# EAGLE design quadcopter (EAGLE 9.3.0)
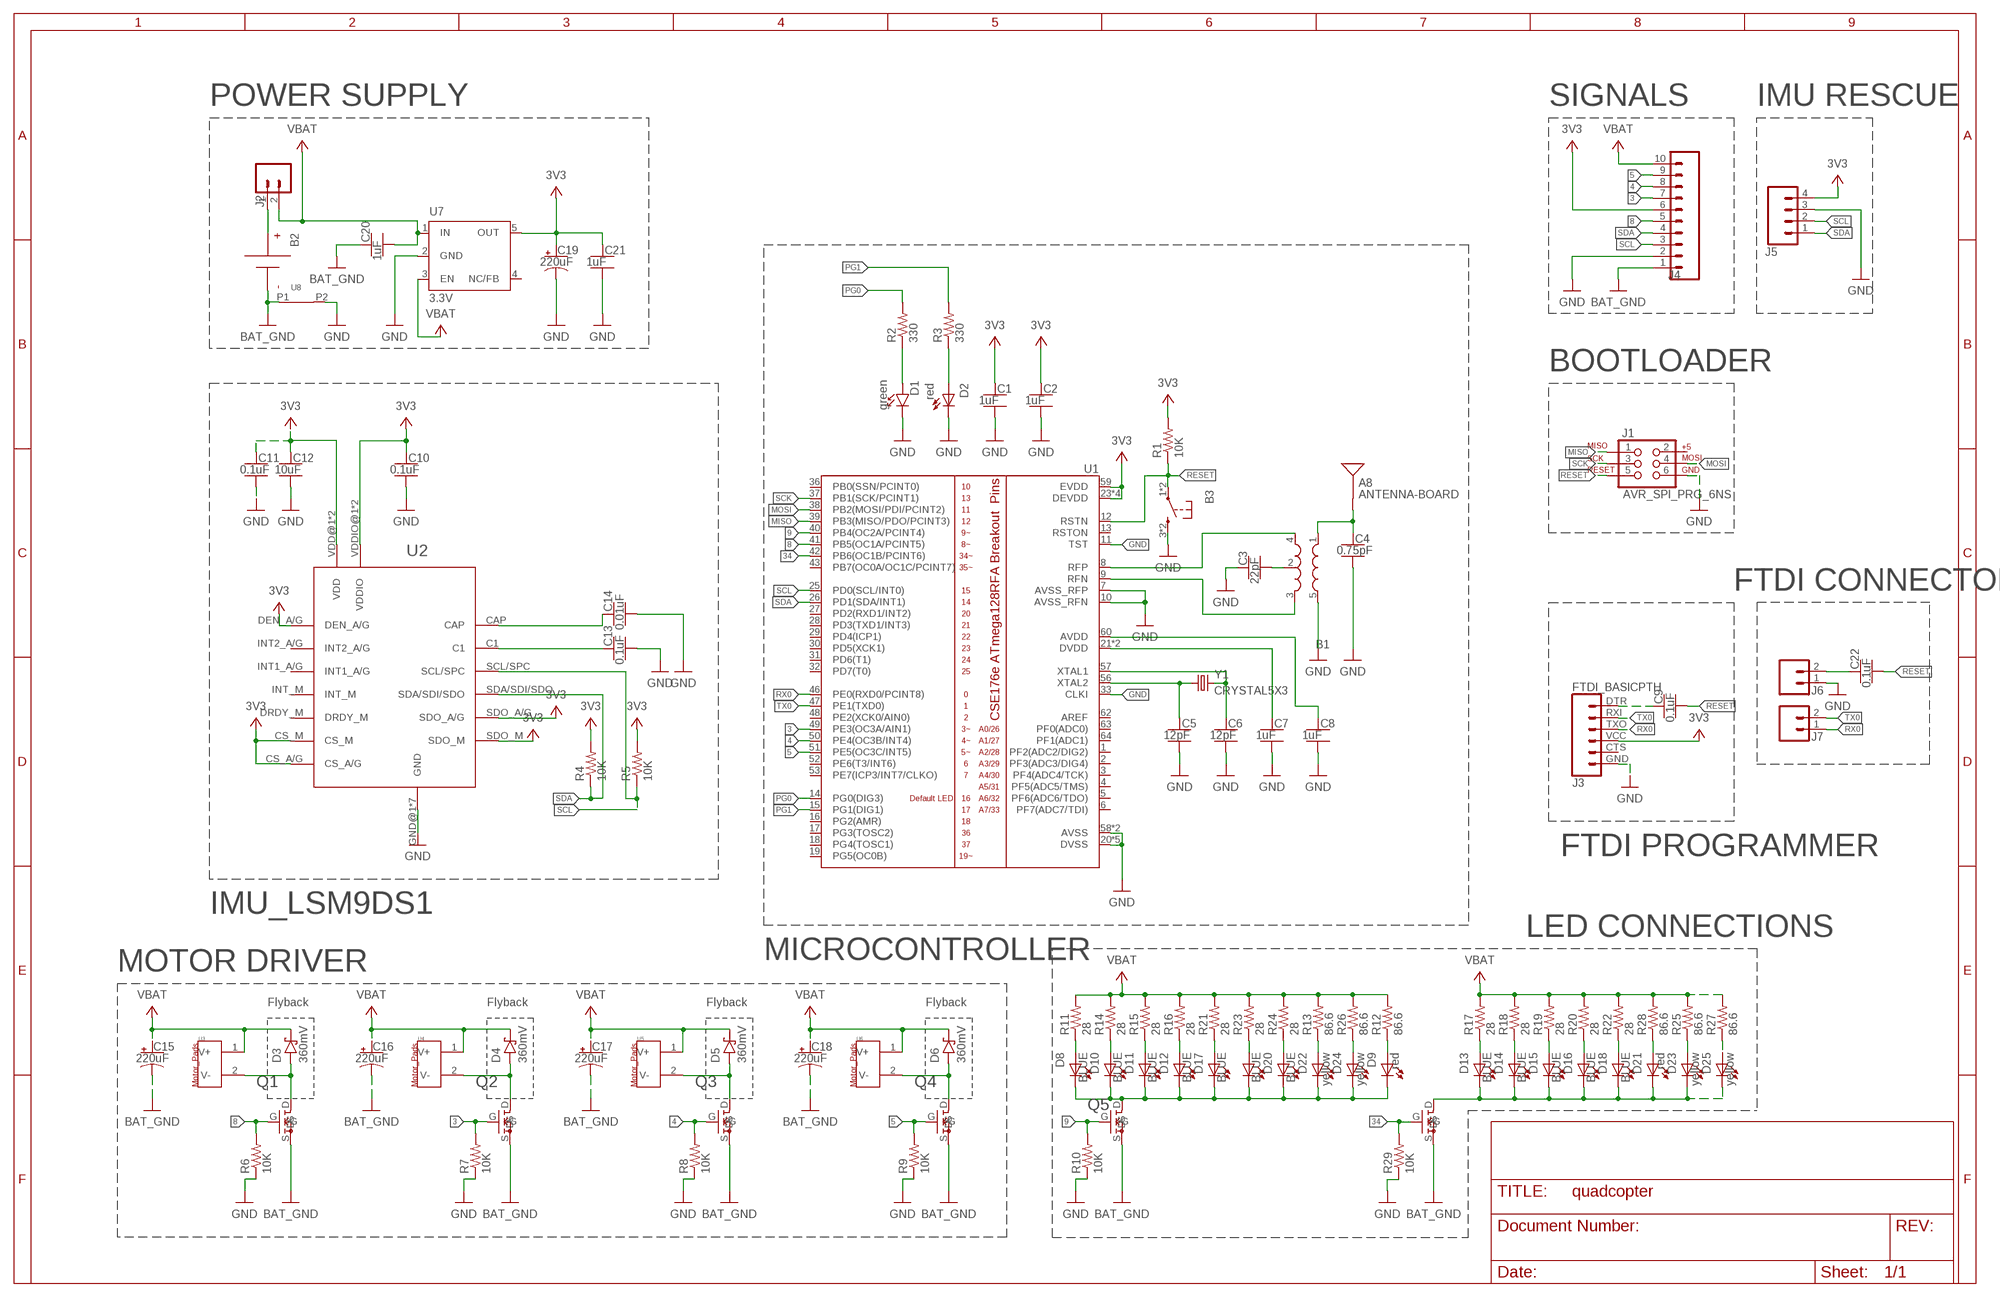
[diagram p0: schematic, sheet 1]
FRAME1 (FRAME_B_L): CREATOR: Unknown; DIST: Unknown; DISTPN: Unknown

## Parts
A8  ANTENNA-BOARD  [ANT_PCB_2.4GHZ_NRF8001_1.6MM_1OZ]
B1  BALUN0805  [BALUN]
B2  BATTERY-SCREW-TERMINAL  [SCREW-TERMINAL-1X2-2.54MM]
B3  PUSHBUTTON_-4.5X4.5  [4.5MM_TACTILE_SWITCH_TL3305AF160QG]
C1  1uF  CAPACITOR-NP_SMD-2012-0805_CERAMIC-1UF  [CAPC2012X140_HS]
C2  1uF  CAPACITOR-NP_SMD-2012-0805_CERAMIC-1UF  [CAPC2012X140_HS]
C3  22pF  CAPACITOR-NP_SMD-2012-0805_CERAMIC-22PF  [CAPC2012X140_HS]
C4  0.75pF  CAPACITOR-NP_SMD-2012-0805_CERAMIC-0.75PF  [CAPC2012X140_HS]
C5  12pF  CAPACITOR-NP_SMD-2012-0805_CERAMIC-12PF  [CAPC2012X140_HS]
C6  12pF  CAPACITOR-NP_SMD-2012-0805_CERAMIC-12PF  [CAPC2012X140_HS]
C7  1uF  CAPACITOR-NP_SMD-2012-0805_CERAMIC-1UF  [CAPC2012X140_HS]
C8  1uF  CAPACITOR-NP_SMD-2012-0805_CERAMIC-1UF  [CAPC2012X140_HS]
C9  0.1uF  CAPACITOR-NP_SMD-2012-0805_CERAMIC-0.1UF  [CAPC2012X140_HS]
C10  0.1uF  CAPACITOR-NP_SMD-2012-0805_CERAMIC-0.1UF  [CAPC2012X140_HS]
C11  0.1uF  CAPACITOR-NP_SMD-2012-0805_CERAMIC-0.1UF  [CAPC2012X140_HS]
C12  10uF  CAPACITOR-NP_SMD-2012-0805_CERAMIC-10UF  [CAPC2012X140_HS]
C13  0.1uF  CAPACITOR-NP_SMD-2012-0805_CERAMIC-0.1UF  [CAPC2012X140_HS]
C14  0.01uF  CAPACITOR-NP_SMD-2012-0805_CERAMIC-0.01UF  [CAPC2012X140_HS]
C15  220uF  CAPACITOR-POL_SMD-7043-D_TANTALUM-220UF  [CAPMP7343X310_HS]
C16  220uF  CAPACITOR-POL_SMD-7043-D_TANTALUM-220UF  [CAPMP7343X310_HS]
C17  220uF  CAPACITOR-POL_SMD-7043-D_TANTALUM-220UF  [CAPMP7343X310_HS]
C18  220uF  CAPACITOR-POL_SMD-7043-D_TANTALUM-220UF  [CAPMP7343X310_HS]
C19  220uF  CAPACITOR-POL_SMD-7043-D_TANTALUM-220UF  [CAPMP7343X310_HS]
C20  1uF  CAPACITOR-NP_SMD-2012-0805_CERAMIC-1UF  [CAPC2012X140_HS]
C21  1uF  CAPACITOR-NP_SMD-2012-0805_CERAMIC-1UF  [CAPC2012X140_HS]
C22  0.1uF  CAPACITOR-NP_SMD-2012-0805_CERAMIC-0.1UF  [CAPC2012X140_HS]
D1  green  DIODE-LED_SMD-2012-0805-GREEN  [LEDSC125X200X120-2_HS]
D2  red  DIODE-LED-LITEON-C170EKT-RED-LITEON-C170EKT-RED-LED  [LED]
D3  360mV  DIODE-SCHOTTKY_SMD-SOD123-360MV  [SOD3716X135_HS]
D4  360mV  DIODE-SCHOTTKY_SMD-SOD123-360MV  [SOD3716X135_HS]
D5  360mV  DIODE-SCHOTTKY_SMD-SOD123-360MV  [SOD3716X135_HS]
D6  360mV  DIODE-SCHOTTKY_SMD-SOD123-360MV  [SOD3716X135_HS]
D8  BLUE  DIODE-LED-SMD-2012-0805-BLUE-BLUE  [DIODE-LED-LTST-C170]
D9  red  DIODE-LED-SMD-2012-0805-RED-RED  [DIODE-LED-LTST-C170]
D10  BLUE  DIODE-LED-SMD-2012-0805-BLUE-BLUE  [DIODE-LED-LTST-C170]
D11  BLUE  DIODE-LED-SMD-2012-0805-BLUE-BLUE  [DIODE-LED-LTST-C170]
D12  BLUE  DIODE-LED-SMD-2012-0805-BLUE-BLUE  [DIODE-LED-LTST-C170]
D13  BLUE  DIODE-LED-SMD-2012-0805-BLUE-BLUE  [DIODE-LED-LTST-C170]
D14  BLUE  DIODE-LED-SMD-2012-0805-BLUE-BLUE  [DIODE-LED-LTST-C170]
D15  BLUE  DIODE-LED-SMD-2012-0805-BLUE-BLUE  [DIODE-LED-LTST-C170]
D16  BLUE  DIODE-LED-SMD-2012-0805-BLUE-BLUE  [DIODE-LED-LTST-C170]
D17  BLUE  DIODE-LED-SMD-2012-0805-BLUE-BLUE  [DIODE-LED-LTST-C170]
D18  BLUE  DIODE-LED-SMD-2012-0805-BLUE-BLUE  [DIODE-LED-LTST-C170]
D19  BLUE  DIODE-LED-SMD-2012-0805-BLUE-BLUE  [DIODE-LED-LTST-C170]
D20  BLUE  DIODE-LED-SMD-2012-0805-BLUE-BLUE  [DIODE-LED-LTST-C170]
D21  red  DIODE-LED-SMD-2012-0805-RED-RED  [DIODE-LED-LTST-C170]
D22  yellow  DIODE-LED-SMD-2012-0805-YELLOW-YELLOW  [DIODE-LED-LTST-C170]
D23  yellow  DIODE-LED-SMD-2012-0805-YELLOW-YELLOW  [DIODE-LED-LTST-C170]
D24  yellow  DIODE-LED-SMD-2012-0805-YELLOW-YELLOW  [DIODE-LED-LTST-C170]
D25  yellow  DIODE-LED-SMD-2012-0805-YELLOW-YELLOW  [DIODE-LED-LTST-C170]
J1  AVR_SPI_PRG_6NS  [2X3-NS]
J2  HEADER-0.1IN-2POS-MALE  [HDRV2W63P254_2X1_508X254H838_HS]
J3  FTDI_BASICPTH  [FTDI_BASIC]
J4  HEADER-10POSTH-254X10  [HDRV10W63P254_10X1_2540X254H838_HS]
J5  HEADER-4POS-0.1IN-FEMALE  [HDRVR4W80P254_1X4_1066X254X850B]
J6  HEADER-0.1IN-2POS-FEMALE  [HDRV2W63P254_2X1_508X254H838_HS]
J7  HEADER-0.1IN-2POS-FEMALE  [HDRV2W63P254_2X1_508X254H838_HS]
Q1  MOSFET-VISHAY-SOT23-N-MOSFET  [SOT-23_N_MOSFET]
Q2  MOSFET-VISHAY-SOT23-N-MOSFET  [SOT-23_N_MOSFET]
Q3  MOSFET-VISHAY-SOT23-N-MOSFET  [SOT-23_N_MOSFET]
Q4  MOSFET-VISHAY-SOT23-N-MOSFET  [SOT-23_N_MOSFET]
Q5  MOSFET-VISHAY-SOT23-N-MOSFET  [SOT-23_N_MOSFET]
Q6  MOSFET-VISHAY-SOT23-N-MOSFET  [SOT-23_N_MOSFET]
R1  10K  RESISTOR_SMD-2012-0805-10K  [RESC2012X60_HS]
R2  330  RESISTOR_SMD-2012-0805-330  [RESC2012X60_HS]
R3  330  RESISTOR_SMD-2012-0805-330  [RESC2012X60_HS]
R4  10K  RESISTOR_SMD-2012-0805-10K  [RESC2012X60_HS]
R5  10K  RESISTOR_SMD-2012-0805-10K  [RESC2012X60_HS]
R6  10K  RESISTOR_SMD-2012-0805-10K  [RESC2012X60_HS]
R7  10K  RESISTOR_SMD-2012-0805-10K  [RESC2012X60_HS]
R8  10K  RESISTOR_SMD-2012-0805-10K  [RESC2012X60_HS]
R9  10K  RESISTOR_SMD-2012-0805-10K  [RESC2012X60_HS]
R10  10K  RESISTOR_SMD-2012-0805-10K  [RESC2012X60_HS]
R11  28  RESISTOR_SMD-2012-0805-28  [RESC2012X60_HS]
R12  86.6  RESISTOR_SMD-2012-0805-88.6  [RESC2012X60_HS]
R13  86.6  RESISTOR_SMD-2012-0805-88.6  [RESC2012X60_HS]
R14  28  RESISTOR_SMD-2012-0805-28  [RESC2012X60_HS]
R15  28  RESISTOR_SMD-2012-0805-28  [RESC2012X60_HS]
R16  28  RESISTOR_SMD-2012-0805-28  [RESC2012X60_HS]
R17  28  RESISTOR_SMD-2012-0805-28  [RESC2012X60_HS]
R18  28  RESISTOR_SMD-2012-0805-28  [RESC2012X60_HS]
R19  28  RESISTOR_SMD-2012-0805-28  [RESC2012X60_HS]
R20  28  RESISTOR_SMD-2012-0805-28  [RESC2012X60_HS]
R21  28  RESISTOR_SMD-2012-0805-28  [RESC2012X60_HS]
R22  28  RESISTOR_SMD-2012-0805-28  [RESC2012X60_HS]
R23  28  RESISTOR_SMD-2012-0805-28  [RESC2012X60_HS]
R24  28  RESISTOR_SMD-2012-0805-28  [RESC2012X60_HS]
R25  86.6  RESISTOR_SMD-2012-0805-88.6  [RESC2012X60_HS]
R26  86.6  RESISTOR_SMD-2012-0805-88.6  [RESC2012X60_HS]
R27  86.6  RESISTOR_SMD-2012-0805-88.6  [RESC2012X60_HS]
R28  86.6  RESISTOR_SMD-2012-0805-88.6  [RESC2012X60_HS]
R29  10K  RESISTOR_SMD-2012-0805-10K  [RESC2012X60_HS]
U1  ATMEGA128RFA1  [QFN-64]
U2  IMU_LSM-ST-LSM9DS1-IMU-LGA  [LSM9DS1_IMU]
U3  MOTOR_PADS-MOLEX-0530470210  [MOLEX-0530470210]
U4  MOTOR_PADS-MOLEX-0530470210  [MOLEX-0530470210]
U5  MOTOR_PADS-MOLEX-0530470210  [MOLEX-0530470210]
U6  MOTOR_PADS-MOLEX-0530470210  [MOLEX-0530470210]
U7  3.3V  TPS73633-DBVT3V3  [SOT23-DBV]
U8  NET_BRIDGE-BRIDGE-SMD  [NET_BRIDGE]
Y1  CRYSTAL5X3  [CRYSTAL-SMD-5X3]

## Nets
3: J4.7 Q2.G R7.2 U1.49(PE3(OC3A/AIN1))
3V3 [PWR]: C1.1 C2.1 C10.1 C11.1 C12.1 C19.1(+) C21.1 J3.VCC J4.6 J5.4 R1.2 R4.2 R5.2 U1.23(DEVDD) U1.34(DEVDD) U1.44(DEVDD) U1.54(DEVDD) U1.59(EVDD) U2.CS_A/G U2.CS_M U2.DEN_A/G U2.SDO_A/G U2.SDO_M U2.VDD@1(VDD) U2.VDD@2(VDD) U2.VDDIO@1(VDDIO) U2.VDDIO@2(VDDIO) U7.5(OUT)
4: J4.8 Q3.G R8.2 U1.50(PE4(OC3B/INT4))
5: J4.9 Q4.G R9.2 U1.51(PE5(OC3C/INT5))
8: J4.5 Q1.G R6.2 U1.41(PB5(OC1A/PCINT5))
9: Q5.G R10.2 U1.40(PB4(OC2A/PCINT4))
34: Q6.G R29.2 U1.42(PB6(OC1B/PCINT6))
BAT_GND [HIGHCURRENT]: B2.1(N) C15.2(-) C16.2(-) C17.2(-) C18.2(-) C20.1 J4.1 Q1.S Q2.S Q3.S Q4.S Q5.S Q6.S U8.P1
GND [PWR]: B1.5(GND) B3.3 B3.4 C1.2 C2.2 C3.1 C4.2 C5.2 C6.2 C7.2 C8.2 C10.2 C11.2 C12.2 C13.2 C14.2 C19.2(-) C21.2 D1.C D2.C J1.6 J3.GND J4.2 J5.3 J6.1 R6.1 R7.1 R8.1 R9.1 R10.1 R29.1 U1.7(AVSS_RFP) U1.10(AVSS_RFN) U1.11(TST) U1.20(DVSS) U1.24(DVSS) U1.33(CLKI) U1.35(DVSS) U1.45(DVSS) U1.55(DVSS) U1.58(AVSS) U1.61(AVSS) U2.GND@1(GND) U2.GND@2(GND) U2.RES@1(GND) U2.RES@2(GND) U2.RES@3(GND) U2.RES@4(GND) U2.RES@5(GND) U7.2(GND) U8.P2
MISO: J1.1 U1.39(PB3(MISO/PDO/PCINT3))
MOSI: J1.4 U1.38(PB2(MOSI/PDI/PCINT2))
N$1 [RFSIG]: A8.FEED(SIGNAL) B1.1(IN) C4.1
N$2: B1.2(GND) C3.2
N$3: B1.4(OUT1) U1.8(RFP)
N$4: B1.3(OUT2) U1.9(RFN)
N$5: C5.1 U1.56(XTAL2) Y1.1
N$6: C6.1 U1.57(XTAL1) Y1.3
N$7: C7.1 U1.21(DVDD) U1.22(DVDD)
N$8: C8.1 U1.60(AVDD)
N$9: D1.A R2.1
N$10: D2.A R3.1
N$11: C9.1 J3.DTR
N$12: C13.1 U2.C1
N$13: C14.1 U2.CAP
N$14 [HIGHCURRENT]: D3.A Q1.D U3.2(V-)
N$15 [HIGHCURRENT]: B2.2(P) J2.1
N$16 [HIGHCURRENT]: D4.A Q2.D U4.2(V-)
N$17: D21.A R28.1
N$18 [HIGHCURRENT]: D5.A Q3.D U5.2(V-)
N$19: C22.1 J6.2
N$20 [HIGHCURRENT]: D6.A Q4.D U6.2(V-)
N$21: D9.A R12.1
N$23: D24.A R26.1
N$24: D23.A R25.1
N$25: D22.A R13.1
N$26: D20.A R24.1
N$27: D19.A R23.1
N$28: D18.A R22.1
N$29: D17.A R21.1
N$30: D16.A R20.1
N$31: D15.A R19.1
N$32: D14.A R18.1
N$33: D13.A R17.1
N$34: D12.A R16.1
N$35: D11.A R15.1
N$36: D10.A R14.1
N$37: D8.A R11.1
N$38: D8.C D9.C D10.C D11.C D12.C D17.C D19.C D20.C D22.C D24.C Q5.D
N$39: D13.C D14.C D15.C D16.C D18.C D21.C D23.C D25.C Q6.D
N$40: D25.A R27.1
PG0: R2.2 U1.14(PG0(DIG3))
PG1: R3.2 U1.15(PG1(DIG1))
RESET: B3.1 B3.2 C9.2 C22.2 J1.5 R1.1 U1.12(RSTN)
RX0: J3.TXO J7.1 U1.46(PE0(RXD0/PCINT8))
SCK: J1.3 U1.37(PB1(SCK/PCINT1))
SCL: J4.3 J5.2 R5.1 U1.25(PD0(SCL/INT0)) U2.SCL/SPC
SDA: J4.4 J5.1 R4.1 U1.26(PD1(SDA/INT1)) U2.SDA/SDI/SDO
TX0: J3.RXI J7.2 U1.47(PE1(TXD0))
VBAT [HIGHCURRENT]: C15.1(+) C16.1(+) C17.1(+) C18.1(+) C20.2 D3.C D4.C D5.C D6.C J2.2 J4.10 R11.2 R12.2 R13.2 R14.2 R15.2 R16.2 R17.2 R18.2 R19.2 R20.2 R21.2 R22.2 R23.2 R24.2 R25.2 R26.2 R27.2 R28.2 U3.1(V+) U4.1(V+) U5.1(V+) U6.1(V+) U7.1(IN) U7.3(EN)
Unconnected: J1.2 J3.CTS U1.1(PF2(ADC2/DIG2)) U1.2(PF3(ADC3/DIG4)) U1.3(PF4(ADC4/TCK)) U1.4(PF5(ADC5/TMS)) U1.5(PF6(ADC6/TDO)) U1.6(PF7(ADC7/TDI)) U1.13(RSTON) U1.16(PG2(AMR)) U1.17(PG3(TOSC2)) U1.18(PG4(TOSC1)) U1.19(PG5(OC0B)) U1.27(PD2(RXD1/INT2)) U1.28(PD3(TXD1/INT3)) U1.29(PD4(ICP1)) U1.30(PD5(XCK1)) U1.31(PD6(T1)) U1.32(PD7(T0)) U1.36(PB0(SSN/PCINT0)) U1.43(PB7(OC0A/OC1C/PCINT7)) U1.48(PE2(XCK0/AIN0)) U1.52(PE6(T3/INT6)) U1.53(PE7(ICP3/INT7/CLKO)) U1.62(AREF) U1.63(PF0(ADC0)) U1.64(PF1(ADC1)) U2.DRDY_M U2.INT1_A/G U2.INT2_A/G U2.INT_M U7.4(NC/FB)

## Notes on the sheet
- POWER SUPPLY | SIGNALS | IMU RESCUE
- BOOTLOADER
- FTDI CONNECTOR
- FTDI PROGRAMMER
- IMU_LSM9DS1
- LED CONNECTIONS
- MICROCONTROLLER
- MOTOR DRIVER
- Flyback | Flyback | Flyback | Flyback

## Library data of the parts
A8 = quadparts_prebuilt:ANTENNA: Single endded antenna.; CREATOR: Swanson; DIST: NA; DISTPN: NA; MOUNTING: NONE
B1 = quadparts_prebuilt:BALUN: A balun to convert differential radio-frequency outputs from the microcontroller into a single-ended driver for the antenna.; CREATOR: Swanson; DATASHEET: http://katalog.we-online.de/pbs/datasheet/748421245.pdf; DIST: Digikey; DISTPN: 732-2230-1-ND; MFR: Wurth Electronics Inc; MOUNTING: SMD; MPN: 748421245; PRICE: 2.63; REVIEWER: Swanson
B2 = quadparts_prebuilt:BATTERY: Connections for a battery.; CREATOR: Swanson; DIST: DIGIKEY; DISTPN: ED10561-ND; MOUNTING: TH; PIN1: -; PIN2: +
B3 = quadparts_prebuilt:PUSHBUTTON_: "Tactile" or "clicky" button.; CREATOR: Swanson; DIST: DIGIKEY; DISTPN: EG5350CT-ND; MOUNTING: SMD
C1 C2 C7 C8 C20 C21 = quadparts_prebuilt:CAPACITOR-NP_: Nonpolarized capacitor; CREATOR: Swanson; DIST: Digikey; DISTPN: 587-1281-1-ND; MFR: Taiyo Yuden; MOUNTING: SMD; MPN: TMK212B7105KG-T; REVIEWER: Swanson
C3 = quadparts_prebuilt:CAPACITOR-NP_: Nonpolarized capacitor; CREATOR: Swanson; DIST: Digikey; DISTPN: 490-5534-1-ND; MFR: Murata Electronics North America; MOUNTING: SMD; MPN: GRM21A5C2E220JW01D; REVIEWER: Swanson
C4 = quadparts_prebuilt:CAPACITOR-NP_: Nonpolarized capacitor; CREATOR: Swanson; DIST: Digikey; DISTPN: 490-3585-1-ND; MFR: Murata Electronics North America; MOUNTING: SMD; MPN: GQM2195C2AR75CB01D; REVIEWER: Swanson
C5 C6 = quadparts_prebuilt:CAPACITOR-NP_: Nonpolarized capacitor; CREATOR: Swanson; DIST: Digikey; DISTPN: 490-5531-1-ND; MFR: Murata Electronics North America; MOUNTING: SMD; MPN: GRM21A5C2E120JW01D; REVIEWER: Swanson
C9-C11 C13 C22 = quadparts_prebuilt:CAPACITOR-NP_: Nonpolarized capacitor; CREATOR: Swanson; DIST: Digikey; DISTPN: 445-1418-1-ND; MFR: TDK; MOUNTING: SMD; MPN: C2012X7R2A104K125AA; REVIEWER: Swanson
C12 = quadparts_prebuilt:CAPACITOR-NP_: Nonpolarized capacitor; CREATOR: Swanson; DIST: Digikey; DISTPN: 445-5984-1-ND; MOUNTING: SMD; REVIEWER: Swanson
C14 = quadparts_prebuilt:CAPACITOR-NP_: Nonpolarized capacitor; CREATOR: Swanson; DIST: Digikey; DISTPN: 1608-1458-1-ND; MFR: Knowles Syfer; MOUNTING: SMD; MPN: 0805J0500104KJT; REVIEWER: Swanson
C15-C19 = quadparts_prebuilt:CAPACITOR-POL_: Polarized capacitor; CREATOR: Swanson; DIST: Digikey; DISTPN: 478-8912-1-ND; MFR: AVX Corporation; MOUNTING: SMD; MPN: TAJD227K006RNJ; REVIEWER: Swanson
D1 = quadparts_prebuilt:DIODE-LED_: Light emitting diode; CREATOR: Swanson; DIST: Digikey; DISTPN: 160-1179-1-ND; MFR: Lite-On Inc; MOUNTING: SMD; MPN: LTST-C170GKT; REVIEWER: Swanson
D2 = LED:DIODE-LED-LITEON-C170EKT-RED: LITEON_RED_LED Technical specifications: Reverse Voltage: 5 V. Power Dissipation: 100 mW. Peak Forward Current: 120 mA. Continuous Forward Current: 30 mA. Operating Temperature: -55 °C to 85 °C.; CREATOR: Yangsheng Hu; DIST: Digikey; DISTPN: 160-1178-1-ND
D3-D6 = quadparts_prebuilt:DIODE-SCHOTTKY_: Schottky diode; CREATOR: Swanson; DIST: Digikey; DISTPN: CRS08QMCT-ND; MFR: Toshiba Semiconductor and Storage; MOUNTING: SMD; MPN: CRS08(TE85L,Q,M); REVIEWER: Swanson
D8 D10-D20 = LED:DIODE-LED-SMD-2012-0805-BLUE: light emitting diode; CREATOR: Pengcheng; DIST: Digikey; DISTPN: 160-1579-1-ND; MFR: Lite-On Inc; MOUNTING: SMD; MPN: LTST-C170TBKT
D9 D21 = LED:DIODE-LED-SMD-2012-0805-RED: light emitting diode; CREATOR: Pengcheng; DIST: Digikey; DISTPN: 160-1415-1-ND; MFR: Lite-on Inc; MOUNTING: SMD; MPN: LTST-C170KRKT
D22-D25 = LED:DIODE-LED-SMD-2012-0805-YELLOW: light emitting diode; CREATOR: Pengcheng; DIST: DigiKey; DISTPN: 160-1416-1-ND; MFR: Lite-On Inc; MOUNTING: SMD; MPN: LTST-C170KSKT
J1 = quadparts_prebuilt:AVR_SPI_PRG_6: AVR ISP 6 Pin This is the in-system programming (ISP) connector for Atmel Microcontrollers programming.; CREATOR: Swanson; DATASHEET: http://portal.fciconnect.com/Comergent//fci/drawing/67996.pdf; DIST: Digikey; DISTPN: 609-3234-ND; MFR: Amphenol FCI; MOUNTING: TH; MPN: 67997-206HLF; PRICE: 0.31; REVIEWER: Swanson
J2 = quadparts_prebuilt:HEADER-0.1IN-2POS: 2 pin header; CREATOR: Swanson; DIST: Digikey; DISTPN: 3M9447-ND; MOUNTING: TH
J3 = quadparts_prebuilt:FTDI_BASIC: FTDI (USB-serial converter) header bins with labels.; CREATOR: Swanson; DATASHEET: http://portal.fciconnect.com/Comergent//fci/drawing/68015.pdf; DIST: Digikey; DISTPN: 609-3327-ND; MFR: Amphenol FCI; MOUNTING: TH; MPN: 68016-406HLF; PRICE: 0.33; REVIEWER: Swanson
J4 = quadparts_prebuilt:HEADER-10POS: 10 pin single inline pin header, socket, or connector; CREATOR: Swanson; DATASHEET: http://portal.fciconnect.com/Comergent//fci/drawing/68000.pdf; DIST: Digikey; DISTPN: 609-3250-ND; MFR: Amphenol FCI; MOUNTING: TH; MPN: 68000-110HLF; PRICE: 0.55; REVIEWER: Swanson
J5 = quadparts_prebuilt:HEADER-4POS; CREATOR: Swanson; DIST: Digikey; DISTPN: S7002-ND
J6 J7 = quadparts_prebuilt:HEADER-0.1IN-2POS: 2 pin header; CREATOR: Swanson; DIST: Digikey; DISTPN: S7000-ND; MOUNTING: TH; PIN1: 1; PIN2: 2
Q1-Q6 = custom:MOSFET: VISHAY_SOT-23_N_MOSFET Technical specifications: Drain-Source Breakdown Voltage: 20 V. Gate-Threshold Voltage: 0.4~0.85 V. Operating Temperature: -55 °C to 150 °C.; CREATOR: Yangsheng Hu; DIST: Digikey; DISTPN: SI2302CDS-T1-E3CT-ND
R1 R4-R10 R29 = quadparts_prebuilt:RESISTOR_: Resistor; CREATOR: Swanson; DIST: Digikey; DISTPN: 311-10KARCT-ND; MFR: Yageo; MOUNTING: SMD; MPN: RC0805JR-0710KL; REVIEWER: Swanson
R2 R3 = quadparts_prebuilt:RESISTOR_: Resistor; CREATOR: Swanson; DIST: Digikey; DISTPN: 311-330ARCT-ND; MFR: Yageo; MOUNTING: SMD; MPN: RC0805JR-07330RL; REVIEWER: Swanson
R11 R14-R24 = custom:RESISTOR_: Resistor; CREATOR: Yangsheng Hu; DIST: Digikey; DISTPN: 311-28.0CRCT-ND
R12 R13 R25-R28 = custom:RESISTOR_: Resistor; CREATOR: Yangsheng Hu; DIST: Digikey; DISTPN: 311-86.6CRCT-ND
U1 = quadparts_prebuilt:ATMEGA128RFA1: ATmega128RFA1 8-bit AVR Microcontroller with Low Power 2.4GHz Transceiver for ZigBee and IEEE 802.15.4; CREATOR: Swanson; DATASHEET: http://www.atmel.com/Images/Atmel-8266-MCU_Wireless-ATmega128RFA1_Datasheet.pdf; DIST: Digikey; DISTPN: ATMEGA128RFA1-ZU-ND; MFR: Atmel; MOUNTING: SMD; MPN: ATMEGA128RFA1-ZUR00; PRICE: 10.21; REVIEWER: Swanson
U2 = custom:IMU_LSM: ST_LSM9DS1_IMU_LGA Technical specifications: Analog Supply Voltage: 1.9~3.6 V. 3 acceleration channels, 3 angular rate channels, 3 magnetic field channels. 16-bit data output. Operating Temperature: -40 °C to 85 °C.; CREATOR: Yangsheng Hu; DIST: Digikey; DISTPN: 497-14946-1-ND
U3-U6 = quadparts_prebuilt:MOTOR_PADS: Connections a brushed motor.; CREATOR: Swanson; DIST: DIGIKEY; DISTPN: WM1731-ND; MOUNTING: TH
U7 = quadparts_prebuilt:TPS73633-DBVT: LP3985-series voltage regulators.; CREATOR: Swanson; DIST: DIGIKEY; DISTPN: LP3985IM5-3.3/NOPBCT-ND; MOUNTING: SMD
U8 = custom:NET_BRIDGE; CREATOR: Yangsheng; DIST: NA; DISTPN: 1
Y1 = quadparts_prebuilt:CRYSTAL: Crystals to provide clock references for microcontrollers, etc.; CREATOR: Swanson; DATASHEET: http://www.abracon.com/Resonators/abm3b.pdf; DIST: Digikey; DISTPN: 535-9122-1-ND; MFR: Abracon LLC; MOUNTING: SMD; MPN: ABM3B-16.000MHZ-B2-T; PRICE: 0.68; PROD_ID: XTAL-08218; REVIEWER: Swanson

## Net classes
1 RFSIG: width 1.27 mm
2 PWR: width 0.254 mm
3 HIGHCURRENT: width 0.762 mm, drill 0.61 mm

## Board
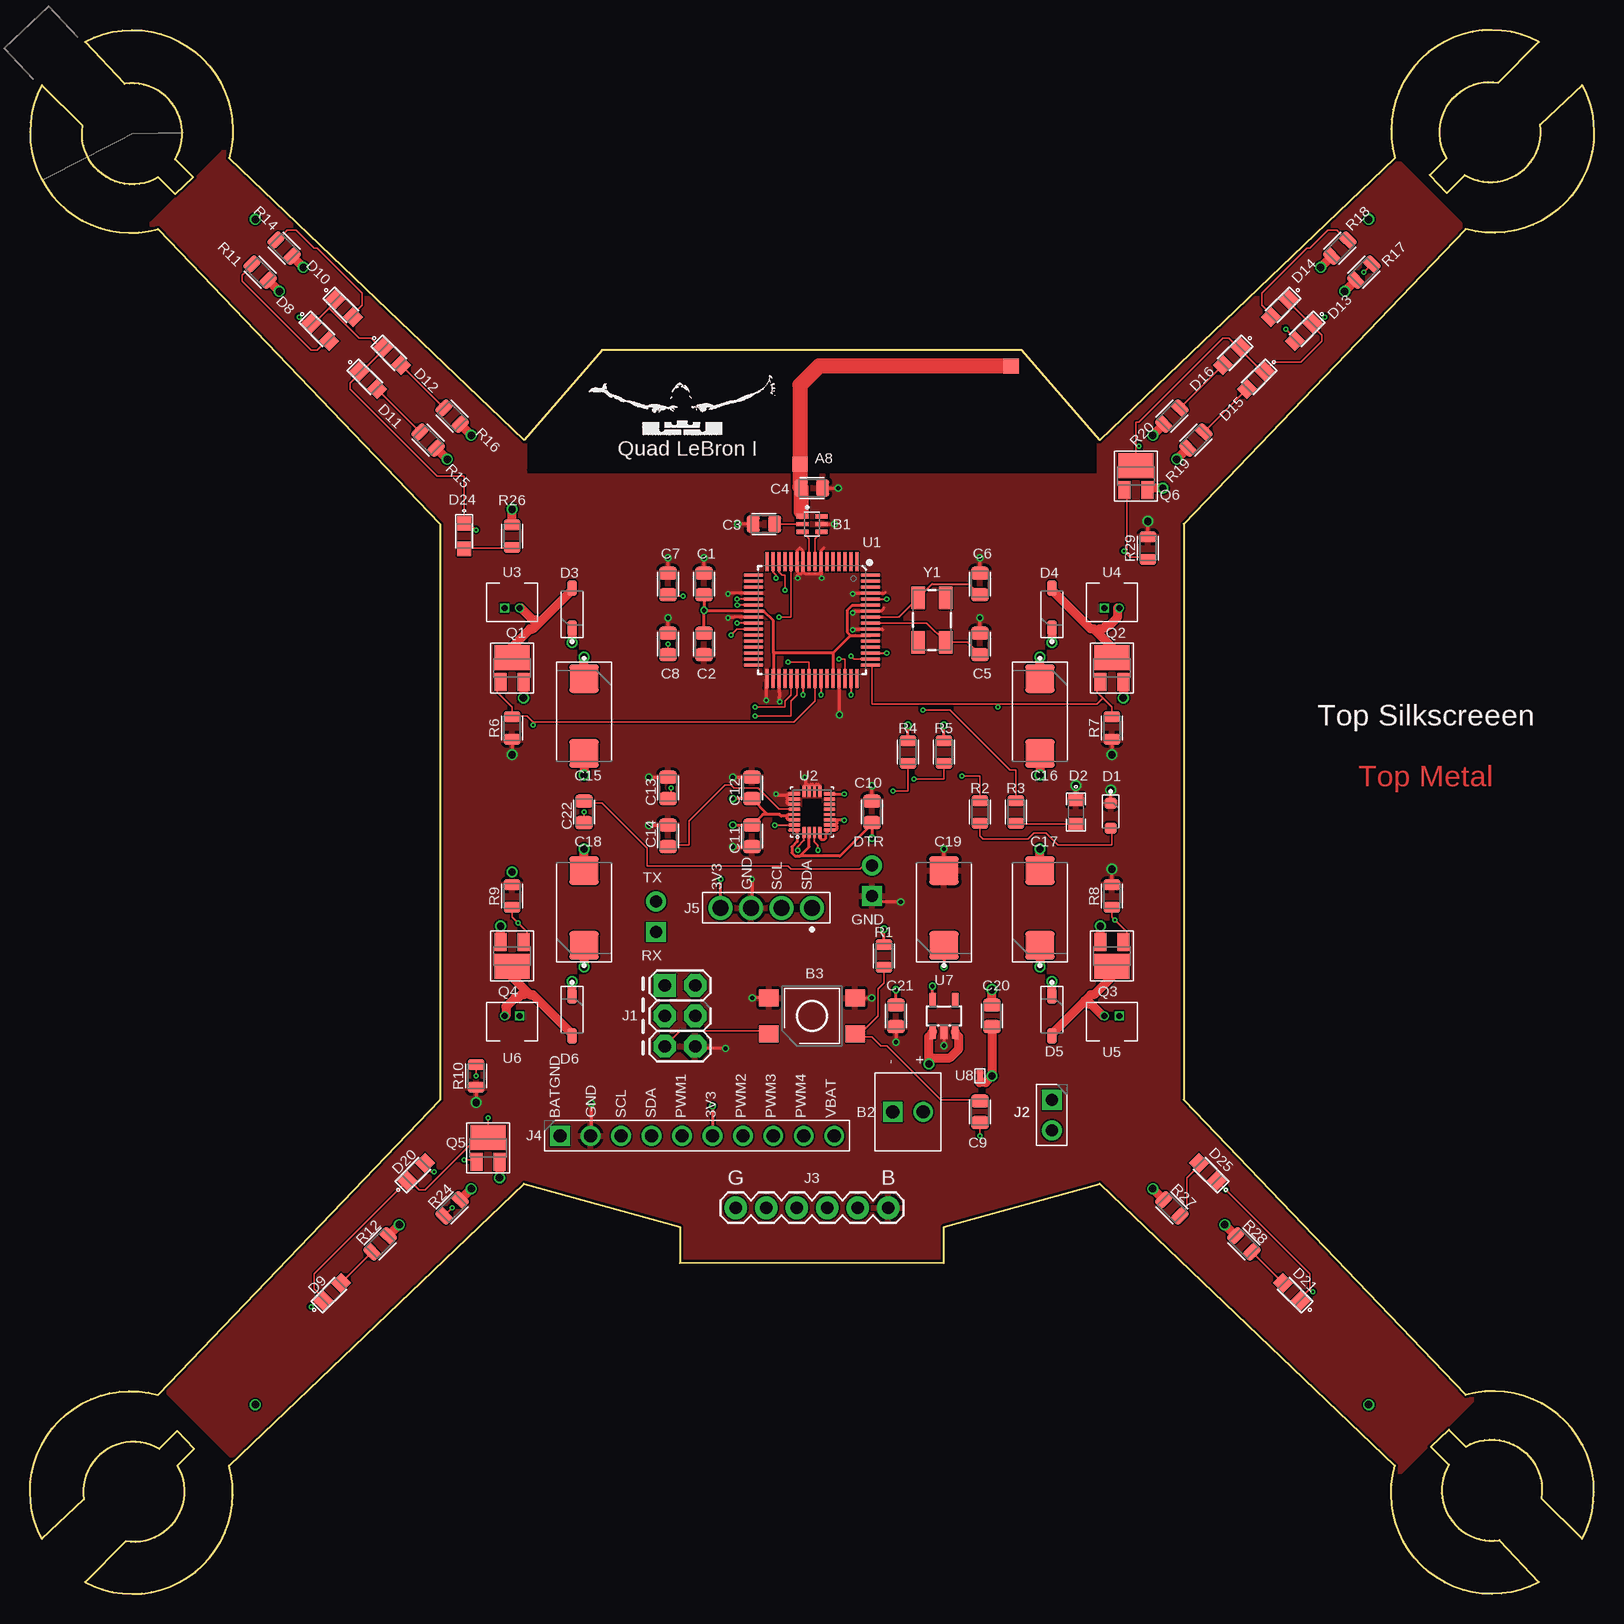
[diagram p1: board, top side]
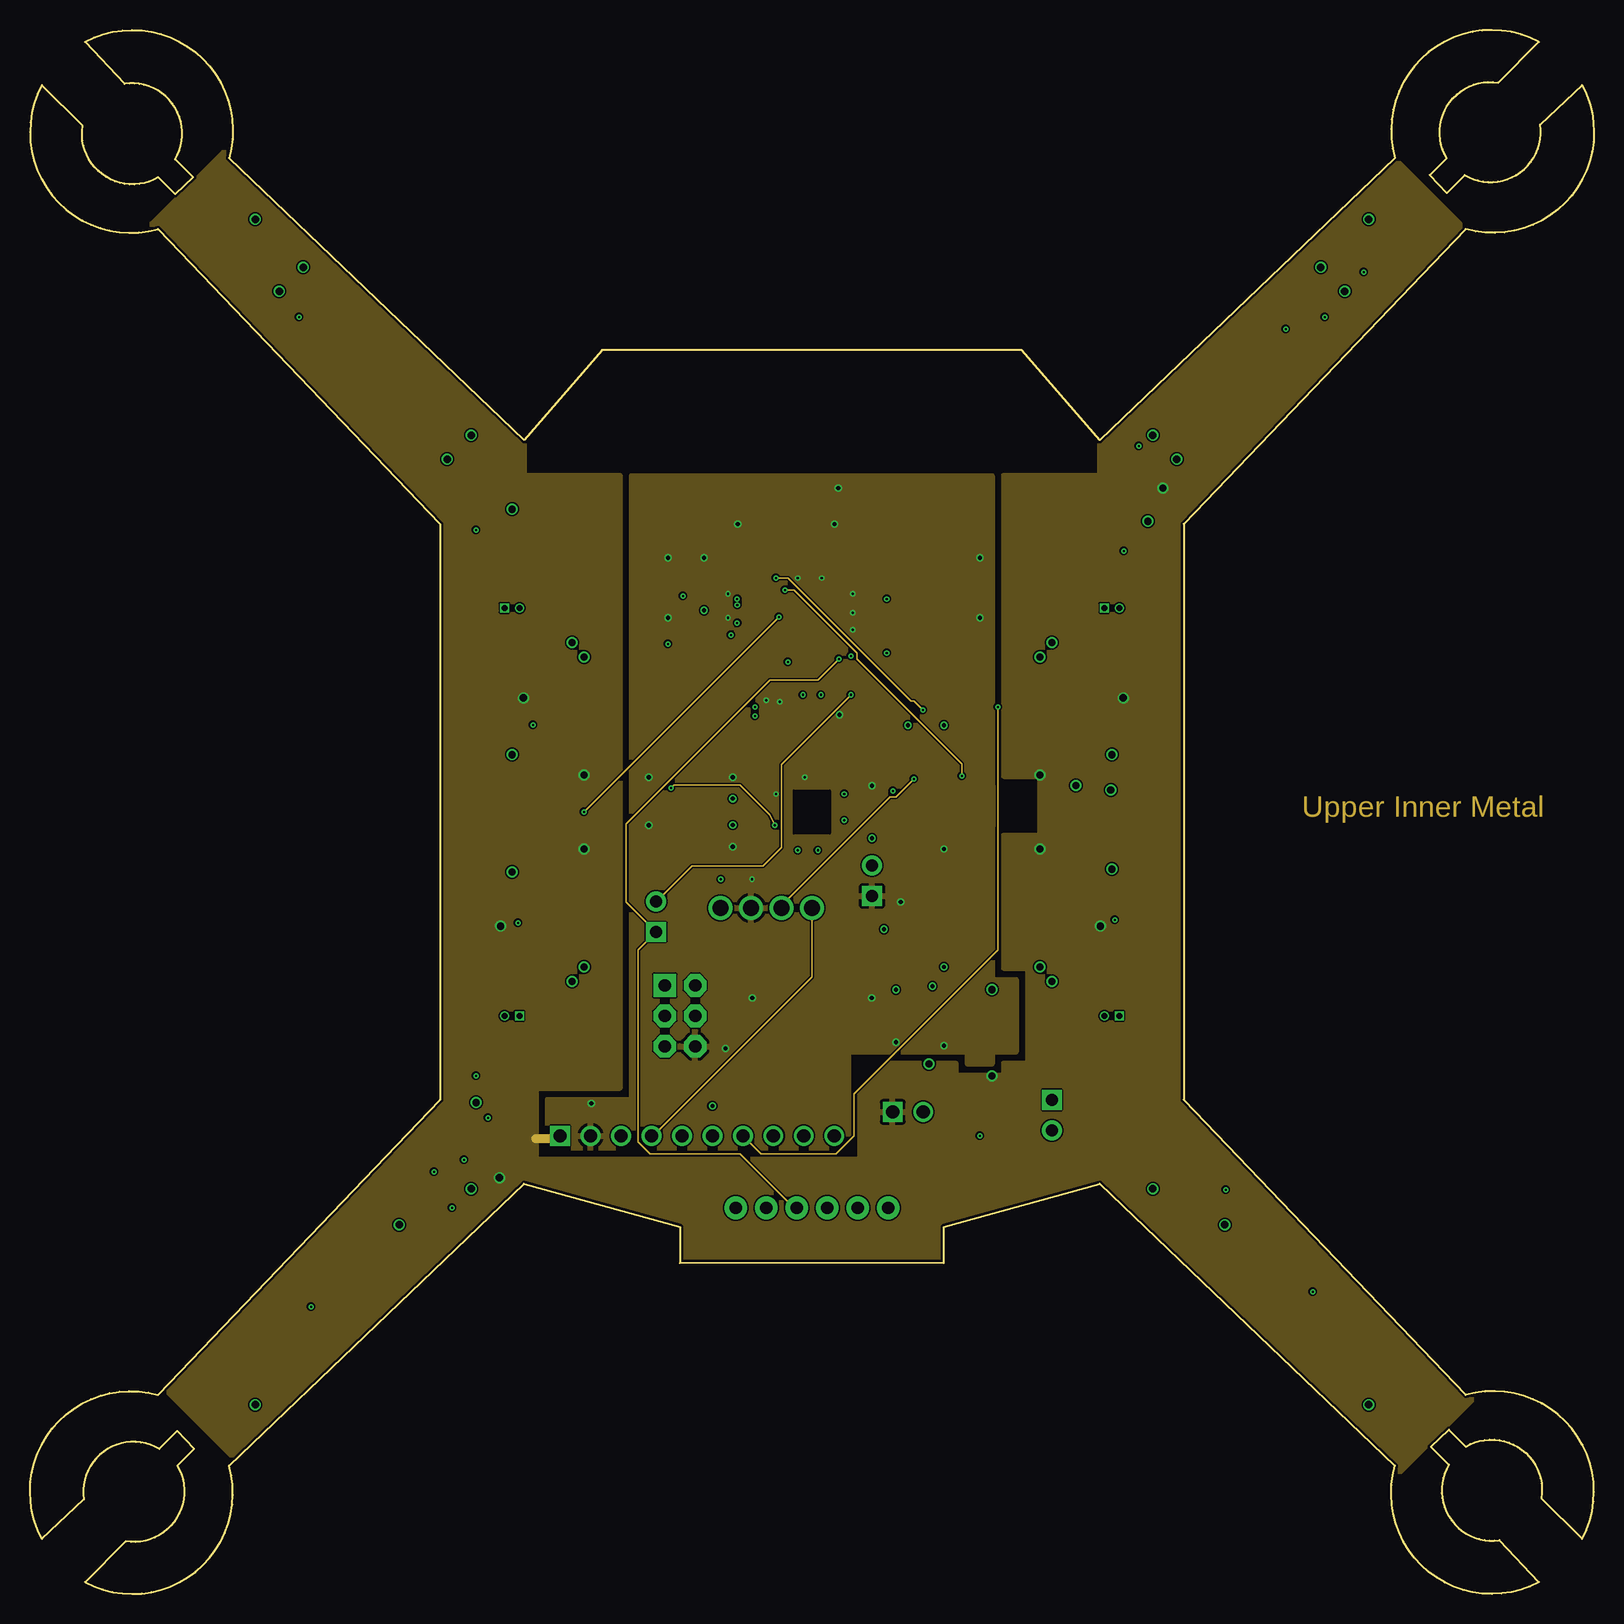
[diagram p2: board, inner layer Route2]
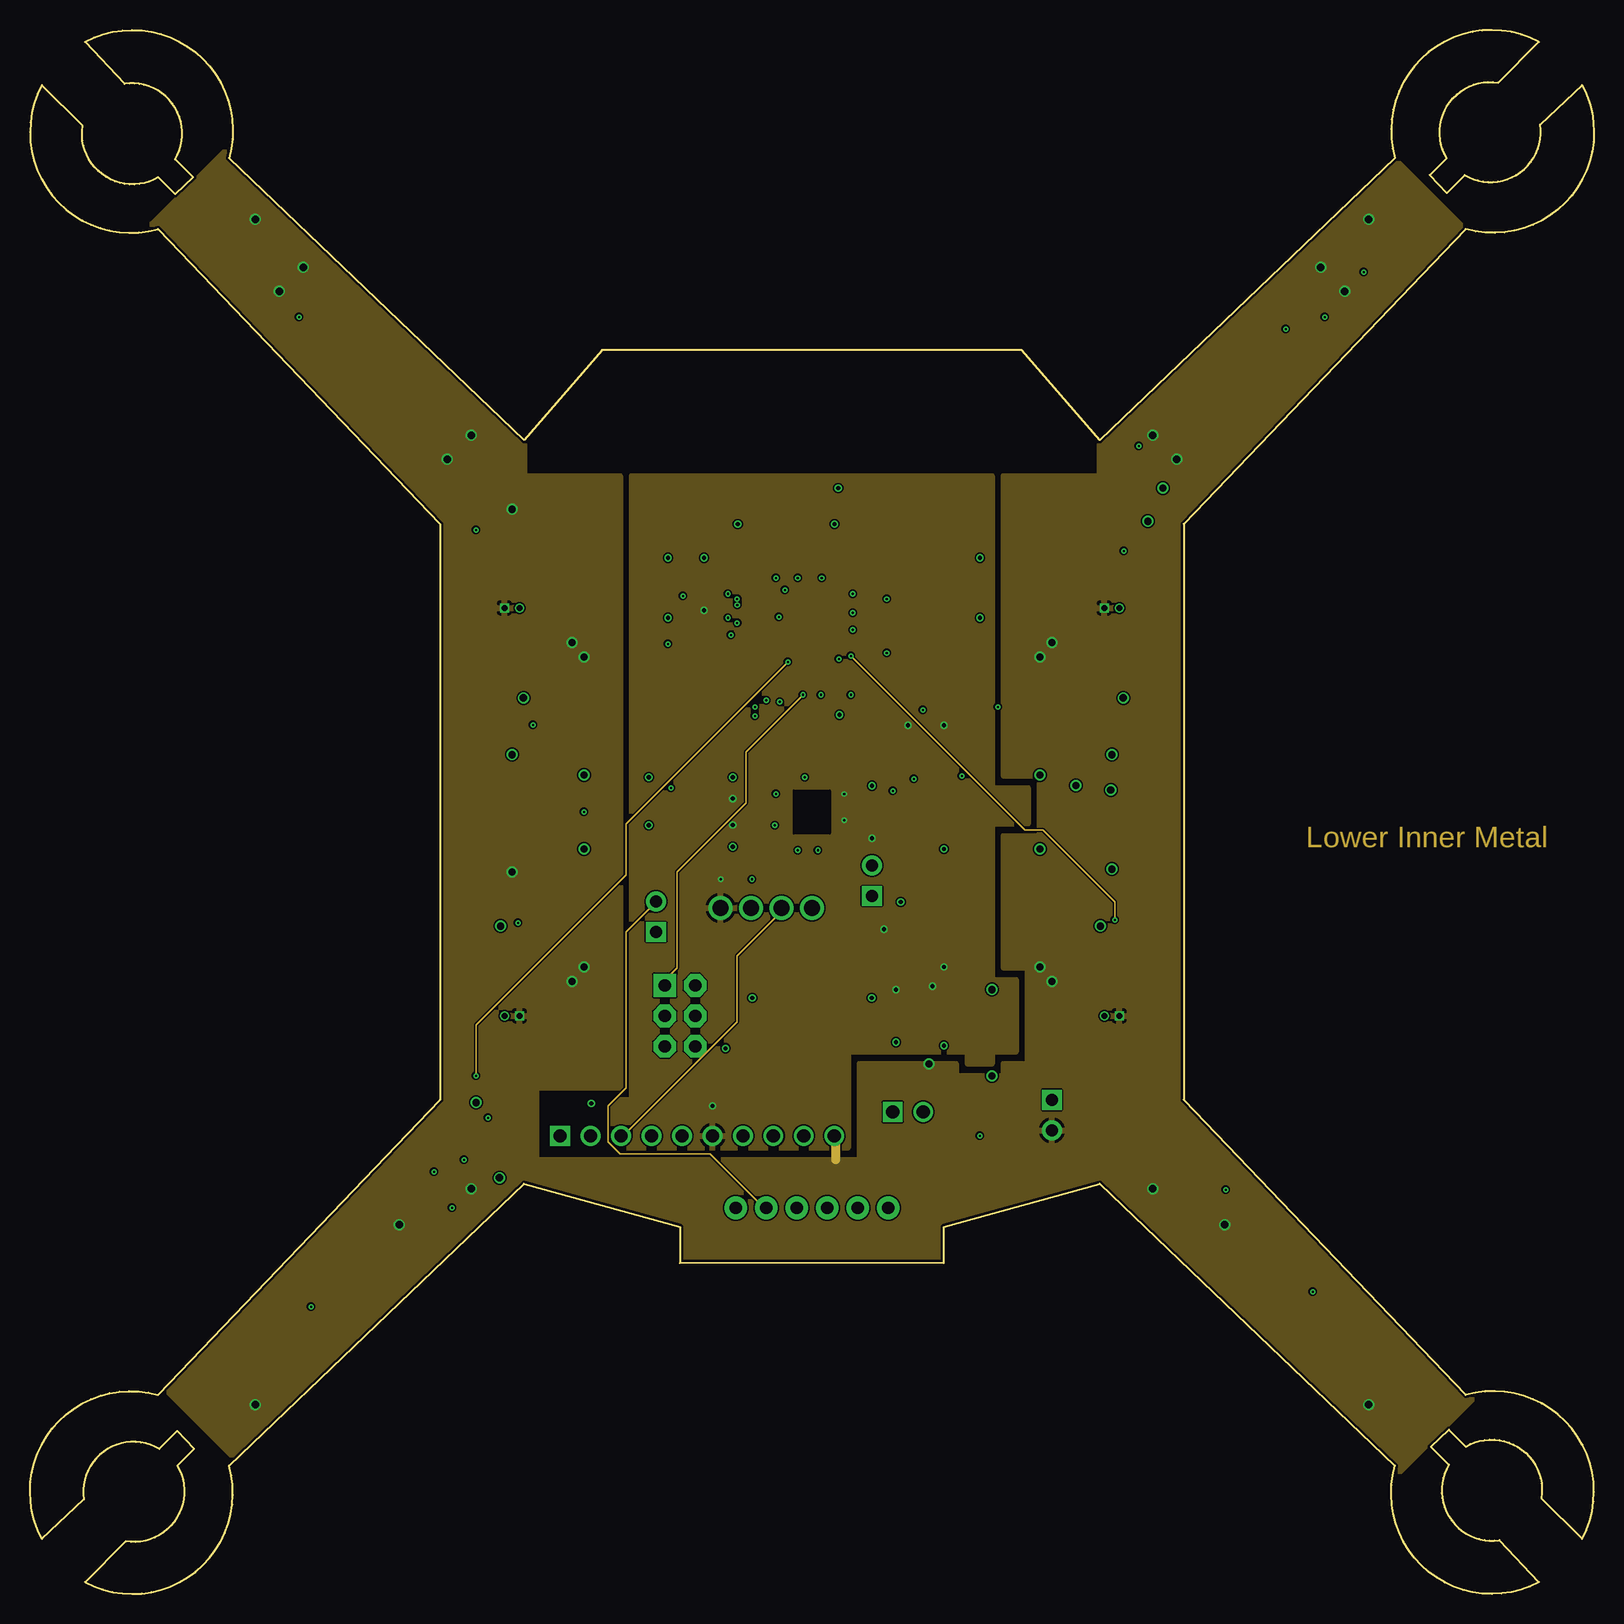
[diagram p3: board, inner layer Route15]
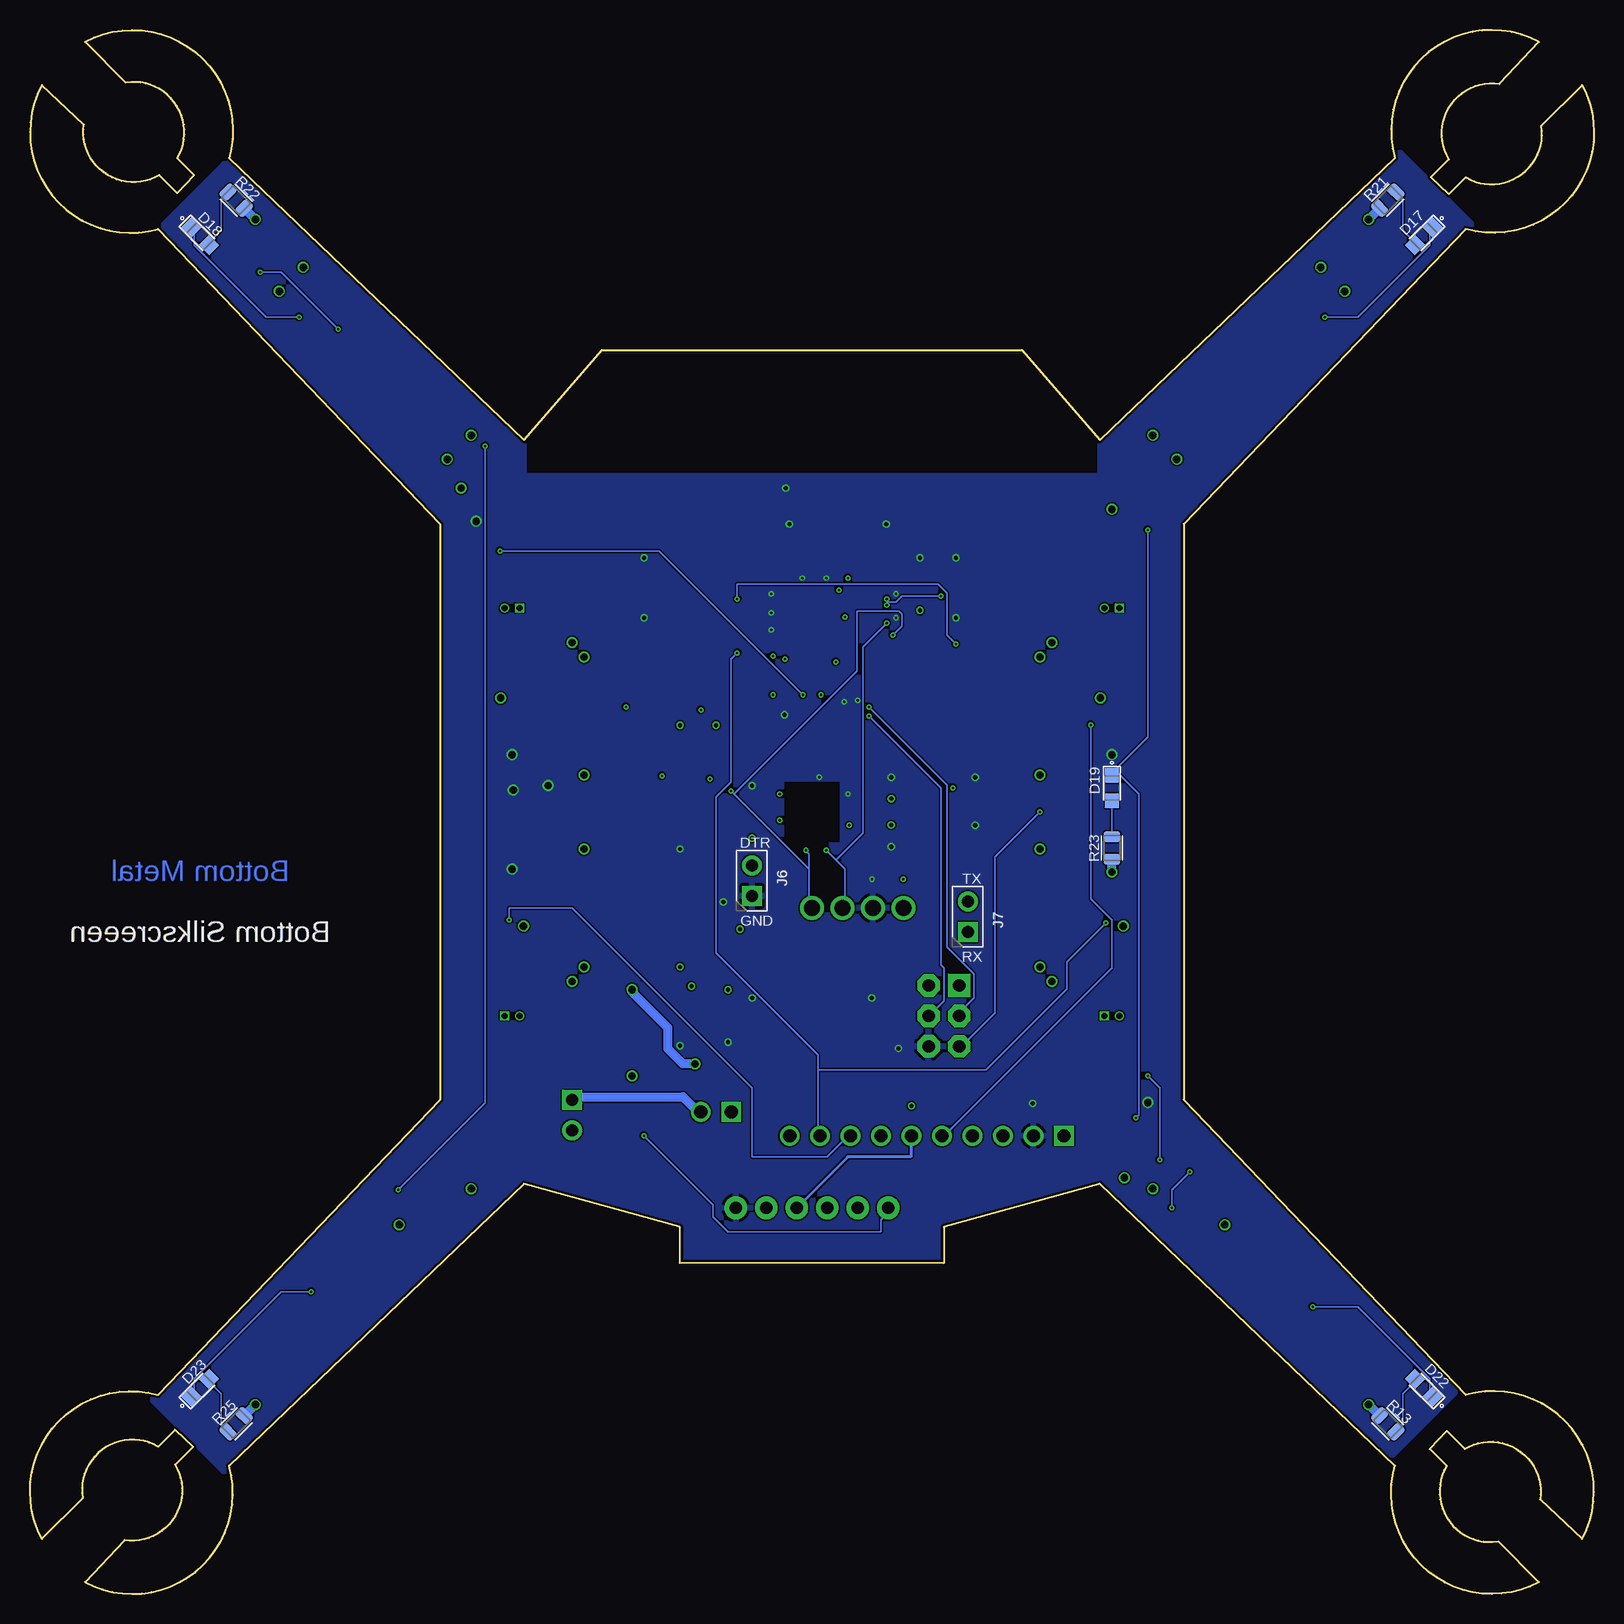
[diagram p4: board, bottom side, seen from below]

Size 130.37 x 130.37 mm. Coordinates in mm from the lower left corner, seen from the top.
Outline: 13.59,118.09 12.09,116.69 10.69,118.09 arc-130 4.39,122.39 0.99,125.79 arc134 10.69,113.79 34.19,89.19 34.19,41.19 10.69,16.59 arc134 0.99,4.59 4.49,7.89 arc-130 10.79,12.09 12.29,13.59 13.69,12.09 12.29,10.69 arc-130 7.99,4.39 4.59,0.99 arc134 16.59,10.69 41.19,34.19 54.19,30.59 54.19,27.59 76.19,27.59 76.19,30.59 89.19,34.19 113.79,10.69 arc134 125.79,0.99 122.49,4.49 arc-130 118.29,10.79 116.79,12.29 118.29,13.69 119.69,12.29 arc-130 125.99,7.99 129.39,4.59 arc134 119.69,16.59 96.19,41.19 96.19,89.19 119.69,113.79 arc134 129.39,125.79 125.89,122.49 arc-130 119.59,118.29 118.09,116.79 116.69,118.29 118.09,119.69 arc-130 122.39,125.99 125.79,129.39 arc134 113.79,119.69 89.19,96.19 82.69,103.69 47.69,103.69 41.19,96.19 16.59,119.69 arc134 4.59,129.39 7.89,125.89 arc-130 12.09,119.59 13.59,118.09
Copper layers (1*2*15*16): Top 0.035559375mm / dielectric 1.501140625mm / Route2 0.035559375mm / dielectric 0.149859375mm / Route15 0.035559375mm / dielectric 0.200659375mm / Bottom 0.035559375mm
Design rules "jlcpcb-4layer-5mil-small-cream": minimum track width 5mil, minimum drill 0.2mm, track to track 5mil, track to pad 5mil, pad to pad 5mil, via to via 5mil, smd to smd 5mil, copper to edge 0.2mm, drill to drill 10mil, minimum pad ring 3mil, minimum via ring 5mil, stop-mask expansion 0.05mm, vias tented up to drill 0.45mm, thermal gap 10mil
tRestrict: 4 lines
bRestrict: 4 lines

### Footprints (pad centres in the part's own frame; a part is rotated, then mirrored left to right if it is on the bottom)
ANT_PCB_2.4GHZ_NRF8001_1.6MM_1OZ = smd 1.27 x 1.27: FEED 0,0; TESTPOINT -8.169,17.605
BALUN = smd 0.35 x 1: 1 -0.65,-0.8; 2 0,-0.8; 3 0.65,-0.8; 4 0.65,0.8; 5 0,0.8; 6 -0.65,0.8
SCREW-TERMINAL-1X2-2.54MM = drill 1.1 square: 1 -1.27,0 | drill 1.1: 2 1.27,0
4.5MM_TACTILE_SWITCH_TL3305AF160QG = smd 1.6 x 1.4: 1 -3.6,-1.5; 2 3.6,-1.5; 3 -3.6,1.5; 4 3.6,1.5
CAPC2012X140_HS = smd 1.08 x 1.42: 1 -0.895,0; 2 0.895,0
CAPMP7343X310_HS = smd 2.37 x 2.43: 1 -3.12,0; 2 3.12,0
LEDSC125X200X120-2_HS = smd 0.94 x 0.99: A -0.345,-0.9; C 1.745,-0.9
LED = smd 1 x 1.25: A -1,0; C 1,0
SOD3716X135_HS = smd 1.25 x 0.8: A 1.665,0; C -1.665,0
DIODE-LED-LTST-C170 = smd 1.2 x 1.2: A -1.05,0; C 1.05,0
2X3-NS = drill 1.016 pad 1.88 square: 1 -2.54,-1.27 | drill 1.016 pad 1.88 octagon: 2 -2.54,1.27; 3 0,-1.27; 4 0,1.27; 5 2.54,-1.27; 6 2.54,1.27
HDRV2W63P254_2X1_508X254H838_HS = drill 1 pad 1.65 square: 1 0,0 | drill 1 pad 1.65: 2 2.54,0
FTDI_BASIC = drill 1.016 pad 1.88: CTS 10.16,0; DTR 0,0; GND 12.7,0; RXI 2.54,0; TXO 5.08,0; VCC 7.62,0
HDRV10W63P254_10X1_2540X254H838_HS = drill 1.1 pad 1.65 square: 1 0,0 | drill 1.1 pad 1.65: 2 2.54,0; 3 5.08,0; 4 7.62,0; 5 10.16,0; 6 12.7,0; 7 15.24,0; 8 17.78,0; 9 20.32,0; 10 22.86,0
HDRVR4W80P254_1X4_1066X254X850B = drill 1.331 pad 1.997: 1 0,0; 2 2.54,0; 3 5.08,0; 4 7.62,0
SOT-23_N_MOSFET = smd 2.9 x 2.05: D 0,0.875 | smd 1 x 1.5: G -0.95,-1.15; S 0.95,-1.15
RESC2012X60_HS = smd 0.92 x 1.38: 1 -0.955,0; 2 0.955,0
QFN-64 = smd 1.562 x 0.28: 1 -4.881,3.75; 2 -4.881,3.25; 3 -4.881,2.75; 4 -4.881,2.25; 5 -4.881,1.75; 6 -4.881,1.25; 7 -4.881,0.75; 8 -4.881,0.25; 9 -4.881,-0.25; 10 -4.881,-0.75; 11 -4.881,-1.25; 12 -4.881,-1.75; 13 -4.881,-2.25; 14 -4.881,-2.75; 15 -4.881,-3.25; 16 -4.881,-3.75; 33 4.881,-3.75; 34 4.881,-3.25; 35 4.881,-2.75; 36 4.881,-2.25; 37 4.881,-1.75; 38 4.881,-1.25; 39 4.881,-0.75; 40 4.881,-0.25; 41 4.881,0.25; 42 4.881,0.75; 43 4.881,1.25; 44 4.881,1.75; 45 4.881,2.25; 46 4.881,2.75; 47 4.881,3.25; 48 4.881,3.75 | smd 0.28 x 1.562: 17 -3.75,-4.881; 18 -3.25,-4.881; 19 -2.75,-4.881; 20 -2.25,-4.881; 21 -1.75,-4.881; 22 -1.25,-4.881; 23 -0.75,-4.881; 24 -0.25,-4.881; 25 0.25,-4.881; 26 0.75,-4.881; 27 1.25,-4.881; 28 1.75,-4.881; 29 2.25,-4.881; 30 2.75,-4.881; 31 3.25,-4.881; 32 3.75,-4.881; 49 3.75,4.881; 50 3.25,4.881; 51 2.75,4.881; 52 2.25,4.881; 53 1.75,4.881; 54 1.25,4.881; 55 0.75,4.881; 56 0.25,4.881; 57 -0.25,4.881; 58 -0.75,4.881; 59 -1.25,4.881; 60 -1.75,4.881; 61 -2.25,4.881; 62 -2.75,4.881; 63 -3.25,4.881; 64 -3.75,4.881
LSM9DS1_IMU = smd 0.28 x 0.9: C1 -1.075,1.45; CAP 0.215,1.45; CS_A/G -1.075,-1.45; CS_M -0.645,-1.45; DEN_A/G 1.505,-1.45; DRDY_M -0.215,-1.45; GND@1 1.075,1.45; GND@2 0.645,1.45; INT1_A/G 0.645,-1.45; INT2_A/G 1.075,-1.45; INT_M 0.215,-1.45; RES@5 1.505,1.45; SDO_M -1.505,-1.45; VDD@1 -0.215,1.45; VDD@2 -0.645,1.45; VDDIO@1 -1.505,1.45 | smd 0.9 x 0.28: RES@1 1.7,-0.645; RES@2 1.7,-0.215; RES@3 1.7,0.215; RES@4 1.7,0.645; SCL/SPC -1.7,0.645; SDA/SDI/SDO -1.7,-0.215; SDO_A/G -1.7,-0.645; VDDIO@2 -1.7,0.215
MOLEX-0530470210 = drill 0.5 square: 1 0.625,0 | drill 0.5: 2 -0.625,0
SOT23-DBV = smd 0.55 x 1.2: 1 -0.95,-1.3; 2 0,-1.3; 3 0.95,-1.3; 4 0.95,1.3; 5 -0.95,1.3
NET_BRIDGE = smd 0.5 x 0.5: P1 -0.2,0; P2 0.2,0
CRYSTAL-SMD-5X3 = smd 1.9 x 1.1: 1 -1.85,-1.15; 2 1.85,-1.15; 3 1.85,1.15; 4 -1.85,1.15

### Placement (x,y rotation side)
A8  64.19,94.19 270 top
B1  65.19,89.19 270 top
B2  73.19,40.19 0 top
B3  65.19,48.19 0 top
C1  56.19,84.19 90 top
C2  56.19,79.19 270 top
C3  61.19,89.19 0 top
C4  65.19,92.19 0 top
C5  79.19,79.19 90 top
C6  79.19,84.19 90 top
C7  53.19,84.19 90 top
C8  53.19,79.19 90 top
C9  79.19,40.19 90 top
C10  70.19,65.19 90 top
C11  60.19,63.19 270 top
C12  60.19,67.19 90 top
C13  53.19,67.19 90 top
C14  53.19,63.19 90 top
C15  46.19,73.19 270 top
C16  84.19,73.19 270 top
C17  84.19,57.19 90 top
C18  46.19,57.19 90 top
C19  76.19,57.19 90 top
C20  80.19,48.19 90 top
C21  72.19,48.19 270 top
C22  46.19,65.19 270 top
D1  89.19,64.19 90 top
D2  87.19,65.19 90 top
D3  45.19,82.19 90 top
D4  85.19,82.19 90 top
D5  85.19,48.19 270 top
D6  45.19,48.19 270 top
D8  24.19,105.19 135 top
D9  25.19,25.19 225 top
D10  26.19,107.19 135 top
D11  28.19,101.19 135 top
D12  30.19,103.19 135 top
D13  106.19,105.19 45 top
D14  104.19,107.19 45 top
D15  102.19,101.19 45 top
D16  100.19,103.19 45 top
D17  14.19,113.19 45 bottom
D18  116.19,113.19 135 bottom
D19  40.19,67.19 90 bottom
D20  32.19,35.19 225 top
D21  105.19,25.19 315 top
D22  14.19,17.19 315 bottom
D23  116.19,17.19 225 bottom
D24  36.19,88.19 90 top
D25  98.19,35.19 315 top
J1  54.19,48.19 270 top
J2  85.19,41.19 270 top
J3  58.84,32.19 0 top
J4  44.19,38.19 0 top
J5  65.19,57.19 180 top
J6  70.19,58.19 90 bottom
J7  52.19,55.19 90 bottom
Q1  40.19,77.19 0 top
Q2  90.19,77.19 0 top
Q3  90.19,53.19 180 top
Q4  40.19,53.19 180 top
Q5  38.19,37.19 0 top
Q6  92.19,93.19 0 top
R1  71.19,53.19 90 top
R2  79.19,65.19 90 top
R3  82.19,65.19 90 top
R4  73.19,70.19 90 top
R5  76.19,70.19 90 top
R6  40.19,72.19 90 top
R7  90.19,72.19 90 top
R8  90.19,58.19 270 top
R9  40.19,58.19 270 top
R10  37.19,43.19 90 top
R11  19.19,110.19 315 top
R12  29.19,29.19 45 top
R13  17.19,14.19 135 bottom
R14  21.19,112.19 315 top
R15  33.19,96.19 315 top
R16  35.19,98.19 315 top
R17  111.19,110.19 225 top
R18  109.19,112.19 225 top
R19  97.19,96.19 225 top
R20  95.19,98.19 225 top
R21  17.19,116.19 225 bottom
R22  113.19,116.19 315 bottom
R23  40.19,62.19 270 bottom
R24  35.19,32.19 45 top
R25  113.19,14.19 45 bottom
R26  40.19,88.19 90 top
R27  95.19,32.19 135 top
R28  101.19,29.19 135 top
R29  93.19,87.19 270 top
U1  65.19,81.19 270 top
U2  65.19,65.19 90 top
U3  40.19,82.19 180 top
U4  90.19,82.19 180 top
U5  90.19,48.19 0 top
U6  40.19,48.19 0 top
U7  76.19,48.19 0 top
U8  79.19,43.19 90 top
U$1  [LEBRON_JAMES]  46.19,94.19 0 top
U$2  [LAYER_LABELS]  116.19,77.19 0 top
Y1  75.19,81.19 90 top

### Tracks (layer width: path | path; a pad name or v marks a point on that pad's centre or on a via)
3  (via drill 0.2)
  Top 0.127: R7.2 90.19,73.94 89.44,74.69 | 89.44,74.69 88.94,75.19 88.94,75.94 89.19,75.94 Q2.G | 80.69,74.19 88.94,74.19 89.44,74.69 | 80.69,74.19 70.19,74.19 70.19,77.44 U1.49 | 80.69,74.19 v80.69,73.94
  Route2 0.127: v80.69,73.94 80.69,53.69 68.69,41.69 68.69,38.19 67.19,36.69 60.94,36.69 J4.7
3V3  (via drill 0.2, 0.35)
  Top 0.254: C1.1 v56.19,82 | R1.2 v71.19,55.41 | R4.2 v73.19,72.41 | R5.2 v76.19,72.41 | C10.1 70.19,64.19 | 70.19,64.19 v70.19,63 | C19.1 v76.19,52.27 | C21.1 v72.19,50.37 | U7.5 v75.24,50.67 | v58.59,66.3 C12.1 61.49,64.99 | U1.54 70.04,79.91 68.79,79.91 68.78,79.9 68.39,79.9 | U1.34 61.96,76.28 61.96,78.49 | 60.28,81.91 U1.23 | U2.VDDIO@2 64.96,63.47 64.96,62.28 64.18,61.5 | 63.28,63.68 U2.VDDIO@1 63.94,63.47 63.94,62.71 63.5,62.27 63.5,61.79 63.79,61.5 64.18,61.5 | 63.08,64.84 63.2,64.96 63.72,64.96 U2.VDD@1 | 63.08,64.84 63.08,64.67 63.2,64.55 63.72,64.55 U2.VDD@2 | 63.08,64.84 62.63,64.84 62.49,64.99 61.49,64.99 | U2.DEN_A/G v67.88,66.69 v67.89,66.69 | v67.89,64.49 67.83,64.54 U2.CS_M 66.65,64.53 67.17,64.53 67.29,64.41 67.29,64.24 67.17,64.12 66.65,64.12 U2.CS_A/G 66.65,64.1 67.17,64.1 67.29,63.98 67.29,63.81 67.17,63.69 66.65,63.69 U2.SDO_M 66.31,63.36 66.31,62.99 66.18,62.85 65.98,62.85 65.84,62.99 65.84,63.47 U2.SDO_A/G | J5.4 57.57,59.57 v57.59,59.59 | v56.89,40.69 J4.6 | v58.59,64.1 58.6,64.08 C11.1 61.09,64.99 61.49,64.99 | 70.19,64.19 67.5,61.5 64.18,61.5 | C2.1 v56.19,82 | 61.96,78.49 61.96,81.13 61.16,81.94 U1.23 | U1.59 70.04,82.41 68.53,82.41 68.1,81.98 68.1,80.19 68.39,79.9 | 68.39,79.9 66.94,78.45 | 66.94,78.45 U1.44 | 66.94,78.45 61.99,78.45 61.96,78.49 | U1.23 56.25,81.94 v56.19,82
  Bottom 0.254: J3.VCC 66.44,32.19 62.19,36.44 56.94,36.44 56.94,38.19 J4.6
  pour Route15: 80.19,91.19 80.19,67.19 83.19,67.19 83.19,64.19 80.19,64.19 80.19,51.19 82.19,51.19 82.19,45.19 80.19,45.19 80.19,44.19 78.19,44.19 78.19,45.19 68.19,45.19 68.19,37.19 43.19,37.19 43.19,41.19 50.19,41.19 50.19,93.19 80.19,93.19
4  (via drill 0.2)
  Top 0.127: R8.2 90.19,56.44 v90.44,56.19 91.44,55.19 91.44,54.44 91.19,54.44 Q3.G | U1.50 68.69,77.94 v68.44,78.19
  Route15 0.127: v68.44,78.19 82.94,63.69 84.44,63.69 90.44,57.69 v90.44,56.19
  Bottom 0.127: v90.44,56.19 90.44,57.19 85.19,57.19 70.19,42.19 70.19,36.44 63.94,36.44 62.19,38.19 J4.8
5  (via drill 0.2)
  Top 0.127: R9.2 40.19,56.44 v40.69,55.94 41.44,55.19 41.44,54.44 41.19,54.44 Q4.G
  Top 0.15: U1.51 v71.43,78.44
  Bottom 0.127: 64.69,43.69 64.69,38.19 J4.9 | 64.69,43.69 64.69,44.94 73.19,53.44 73.19,66.44 71.94,67.69 71.94,77.94 v71.44,78.44 v71.43,78.44 | v40.69,55.94 43.94,52.69 43.94,50.44 50.69,43.69 64.69,43.69
8  (via drill 0.2)
  Top 0.127: 40.19,73.19 40.19,73.94 38.94,75.19 38.94,75.94 39.19,75.94 Q1.G | U1.41 65.44,74.44 63.69,72.69 41.94,72.69 | 41.94,72.69 41.44,73.19 40.19,73.19 | 40.19,73.19 R6.2 | 41.94,72.69 v41.94,72.44
  Bottom 0.127: v41.94,72.44 41.94,57.94 40.19,56.19 40.19,52.19 54.19,38.19 J4.5
9  (via drill 0.2)
  Top 0.127: v37.19,43.19 R10.2 | v36.19,36.19 37.19,36.19 Q5.G | U1.40 64.94,77.69 v63.19,77.69
  Route15 0.127: v63.19,77.69 49.69,64.19 49.69,59.94 37.19,47.44 v37.19,43.19
  Bottom 0.127: v37.19,43.19 36.19,42.19 v36.19,36.19
34  (via drill 0.2)
  Top 0.127: 91.44,86.94 91.44,91.94 Q6.G | 91.44,86.94 91.44,86.69 91.69,86.44 93.19,86.44 R29.2 | 91.44,86.94 v91.19,86.94
  Top 0.15: U1.42 v65.94,74.94
  Bottom 0.127: v91.19,86.94 77.94,86.94 v65.94,74.94
BAT_GND  (via drill 0.61)
  Top 0.15: 79.19,42.63 U8.P1
  Top 0.762: 79.19,42.63 79.65,42.63 80.19,43.17 v80.19,43.19 C20.1 | C18.2 v46.19,62.1 | Q5.S v39.14,34.7 | Q4.S v39.24,55.67 | Q2.S v91.14,74.7 | Q3.S v89.24,55.67 | C15.2 v46.19,68.27 | Q1.S v41.14,74.7 | C17.2 v84.19,62.1 | C16.2 v84.19,68.27 | v94.44,92.19 93.19,92.19 Q6.S
  Route2 0.762: 42.19,37.94 43.94,37.94 J4.1
  pour Route2: 89.19,96.19 89.19,93.19 81.19,93.19 81.19,68.19 84.19,68.19 84.19,63.19 81.19,63.19 81.19,52.19 83.19,52.19 83.19,44.19 81.19,44.19 81.19,43.19 77.19,43.19 77.19,44.19 69.19,44.19 69.19,36.19 42.19,36.19 42.19,42.19 49.19,42.19 49.19,93.19 41.19,93.19 41.19,96.19 16.19,120.19 10.19,114.19 11.19,17.19 17.19,11.19 114.19,10.19 120.19,16.19 119.19,114.19 113.19,120.19
GND  (via drill 0.2, 0.35, 0.61)
  Top 0.254: B1.5 v67.07,89.19 | C8.2 v53.19,81.37 | B3.3 v60.2,49.69 | B3.4 v70.17,49.69 | C6.2 v79.19,86.37 | R10.1 v37.19,40.96 | R7.1 v90.19,69.96 | C4.2 v67.37,92.19 | C5.2 v79.19,81.37 | R29.1 v93.19,89.41 | C3.1 v59,89.19 | C7.2 v53.19,86.37 | D1.C v90.09,67.01 | R6.1 v40.19,69.96 | R8.1 v90.19,60.41 | D2.C v87.19,67.39 | C13.2 53.18,68.07 v51.59,68.07 | C1.2 v56.19,86.37 | C10.2 v70.19,67.37 | C19.2 v76.19,62.1 | C21.2 v72.19,46 | U7.2 v76.19,45.7 | C12.2 60.18,68.07 v58.59,68.07 | 64.09,85.06 63.96,85.19 63.96,86.04 U1.11 63.96,86.09 63.96,86.98 64.09,87.11 64.11,87.11 64.19,87.19 64.26,87.11 64.28,87.11 64.44,86.96 U1.10 | 64.09,85.06 64.28,85.06 64.41,85.19 | 64.41,85.19 64.41,86.04 U1.10 | U1.10 64.46,86.04 | v63.99,84.69 63.99,84.95 64.09,85.06 | v68.59,83.39 68.64,83.44 U1.61 71.24,83.44 71.29,83.49 | v68.59,81.79 68.7,81.9 68.78,81.9 68.82,81.94 U1.58 70.09,81.96 70.98,81.96 71.11,82.09 71.11,82.11 71.19,82.19 | v68.59,80.39 68.64,80.44 U1.55 | v61.39,74.49 61.39,76.25 U1.33 | v62.49,74.39 62.44,74.44 62.44,74.76 62.47,74.79 62.47,75.18 62.44,75.22 U1.35 | v58.19,81.39 58.24,81.44 58.26,81.44 58.29,81.4 58.68,81.4 58.72,81.44 U1.24 | 63.08,66.56 63.2,66.68 63.72,66.68 U2.RES@5 | 63.08,66.56 63.08,66.39 63.2,66.27 63.29,66.27 | 63.29,66.27 63.72,66.27 U2.GND@1 | U2.GND@2 63.72,65.84 63.2,65.84 63.08,65.96 63.08,66.13 63.2,66.25 63.27,66.25 63.29,66.27 | 63.08,66.56 62.31,66.56 v62.19,66.69 | U2.RES@1 65.82,66.9 65.82,67.37 65.7,67.49 65.53,67.49 65.41,67.37 65.41,66.9 U2.RES@2 65.39,66.9 65.39,67.37 65.27,67.49 65.1,67.49 64.98,67.37 64.98,66.9 | U2.RES@4 64.55,66.9 64.55,67.37 64.67,67.49 | 64.67,67.49 64.84,67.49 64.96,67.37 64.96,66.92 64.98,66.9
  Top 0.254: U2.RES@3 64.98,66.9 | 64.67,67.49 64.67,68 v64.59,68.09 | v67.49,73.29 67.49,75.36 67.46,75.39 67.46,76.28 U1.45 | 65.96,85.49 65.92,85.45 | 65.92,85.45 65.91,85.44 | v65.99,84.69 65.99,85.16 65.96,85.19 65.96,86.04 U1.7 | U1.7 65.91,86.04 65.91,85.19 65.75,85.03 64.62,85.03 64.46,85.19 64.41,85.19 | v60.19,59.59 60.19,57.27 J5.3 | U1.20 58.24,83.44 v58.19,83.39 | v46.79,40.89 46.79,38.25 J4.2 | v57.99,45.49 55.62,45.49 J1.6 | v72.59,57.69 70.69,57.69 J6.1 | v51.59,64.09 C14.2 | v58.59,62.29 C11.2 | 65.92,85.45 65.94,85.44 U1.7 | U1.7 65.96,86.09 65.96,86.98 66.09,87.11 66.11,87.11 66.19,87.19 | U1.55 70.09,80.41 | U1.55 71.04,80.44 71.09,80.39
  pour Route2: 80.19,91.19 80.19,67.19 83.19,67.19 83.19,64.19 80.19,64.19 80.19,51.19 82.19,51.19 82.19,45.19 80.19,45.19 80.19,44.19 78.19,44.19 78.19,45.19 68.19,45.19 68.19,37.19 43.19,37.19 43.19,41.19 50.19,41.19 50.19,93.19 80.19,93.19
  pour Top: 16.19,120.19 41.19,96.19 41.19,93.19 89.19,93.19 89.19,96.19 113.19,119.19 114.19,119.19 119.19,114.19 120.19,16.19 114.19,10.19 17.19,11.19 11.19,17.19 10.19,114.19
  pour Bottom: 10.19,114.19 16.19,120.19 41.19,96.19 41.19,93.19 89.19,93.19 89.19,96.19 113.19,119.19 114.19,119.19 120.19,113.19 96.19,89.19 120.19,16.19 114.19,10.19 17.19,11.19 11.19,17.19
LAYER2_CUTOUT
  cutout Route2: 63.69,66.99 66.69,66.99 66.69,63.39 63.69,63.39
LAYER15_CUTOUT
  cutout Route15: 63.69,66.99 66.69,66.99 66.69,63.39 63.69,63.39
MISO  (via drill 0.2)
  Top 0.15: U1.39 v64.44,74.94
  Route15 0.127: v64.44,74.94 59.69,70.19 59.69,65.94 53.94,60.19 53.94,52.19 52.69,50.94 J1.1
MOSI  (via drill 0.2)
  Top 0.127: U1.38 63.94,74.94 63.44,74.44 63.44,73.19 v60.44,73.19
  Bottom 0.127: v60.44,73.19 54.44,67.19 54.44,52.44 54.19,52.19 54.19,49.44 55.44,48.19 J1.4
N$1
  Top 0.127: B1.1 64.29,89.93 64.29,90.22
  Top 1.27: A8.FEED 64.19,92.29 C4.1 64.29,90.22
N$2
  Top 0.127: B1.2 C3.2
N$3
  Top 0.127: B1.4 65.44,87.99 U1.8
N$4
  Top 0.127: B1.3 64.94,87.99 U1.9
N$5
  Top 0.127: U1.56 74.74,80.94 Y1.1 78.14,79.34 C5.1
N$6
  Top 0.127: U1.57 72.44,81.44
  Top 0.152: 72.44,81.44 Y1.3 75.19,84.19 78.29,84.19 C6.1
N$7  (via drill 0.2)
  Top 0.127: v54.44,83.19 53.19,83.19 C7.1
  Top 0.15: U1.21 v58.94,82.94 | U1.22 v58.95,82.44
  Bottom 0.127: v54.44,83.19 57.69,83.19 58.19,82.69 58.94,82.69 | 58.94,82.69 v58.94,82.94 | 58.94,82.69 v58.94,82.44 v58.95,82.44
N$8  (via drill 0.2)
  Top 0.127: v53.19,79.19 C8.1
  Top 0.15: U1.60 v71.43,82.94
  Bottom 0.127: v53.19,79.19 53.94,79.94 53.94,83.44 54.69,84.19 71.44,84.19 v71.44,82.94 v71.43,82.94
N$9
  Top 0.127: R2.1 79.19,63.19 79.44,62.94 83.19,62.94 83.69,63.44 84.69,63.44 85.69,62.44 90.19,62.44 90.19,63.69 D1.A
N$10
  Top 0.127: D2.A 82.19,64.19 R3.1
N$11  (via drill 0.2)
  Top 0.127: v79.19,38.19 C9.1
  Bottom 0.127: v79.19,38.19 73.44,32.44 73.44,31.44 72.19,30.19 59.44,30.19 59.44,31.19 58.94,31.69 58.94,32.19 J3.DTR
N$12  (via drill 0.2)
  Top 0.127: v53.44,67.19 53.44,66.44 53.19,66.44 C13.1
  Top 0.15: v62.09,64.09 63.71,64.09 U2.C1
  Route2 0.127: v53.44,67.19 53.69,67.44 59.19,67.44 61.64,64.99 v62.09,64.09
N$13
  Top 0.127: U2.CAP 63.69,65.44 62.44,65.44 60.69,67.19 58.69,67.19 58.44,67.44 57.94,67.44 54.94,64.44 54.94,62.44 53.19,62.44 C14.1
N$14
  Top 0.762: 42.44,80.94 41.94,80.44 41.69,80.44 40.19,78.94 Q1.D | 42.44,80.94 45.19,83.69 D3.A | U3.2 40.94,82.19 41.94,81.19 42.19,81.19 42.44,80.94
N$15
  Bottom 0.762: J2.1 85.19,41.44 75.94,41.44 74.69,40.19 B2.2
N$16
  Top 0.762: 88.94,80.19 90.19,78.94 Q2.D | 88.94,80.19 88.69,80.44 88.44,80.44 85.19,83.69 D4.A | U4.2 90.69,82.19 90.69,81.44 89.94,80.69 89.69,80.69 89.44,80.44 89.19,80.44 88.94,80.19
N$17
  Top 0.127: D21.A 102.19,28.19 102.19,28.44 101.94,28.44 R28.1
N$18
  Top 0.762: 87.94,49.44 88.44,49.94 88.69,49.94 90.19,51.44 Q3.D | 87.94,49.44 85.19,46.69 D5.A | U5.2 89.44,48.19 88.44,49.19 88.19,49.19 87.94,49.44
N$19
  Top 0.127: C22.1 46.19,65.94 47.69,65.94 51.44,62.19 51.44,60.69 63.19,60.69 63.44,60.44 69.19,60.44 69.44,60.69 70.19,60.69 J6.2
N$20
  Top 0.762: 41.44,50.19 40.19,51.44 Q4.D | 41.44,50.19 41.69,49.94 41.94,49.94 45.19,46.69 D6.A | U6.2 39.69,48.19 39.69,48.94 40.44,49.69 40.69,49.69 40.94,49.94 41.19,49.94 41.44,50.19
N$21
  Top 0.127: D9.A 28.19,28.19 28.19,28.44 28.44,28.44 R12.1
N$23
  Top 0.127: D24.A 36.19,87.19 40.19,87.19 R26.1
N$24
  Bottom 0.127: D23.A 115.44,17.69 114.44,16.69 114.44,14.19 113.94,13.69 R25.1
N$25
  Bottom 0.127: D22.A 14.94,17.69 15.94,16.69 15.94,14.19 16.44,13.69 R13.1
N$26  (via drill 0.2)
  Top 0.127: v33.69,35.19 33.44,35.19 32.94,35.69 D20.A | R24.1 v35.19,32.19
  Bottom 0.127: v33.69,35.19 35.19,33.69 v35.19,32.19
N$27
  Bottom 0.127: R23.1 D19.A
N$28
  Bottom 0.127: D18.A 115.44,112.69 114.44,113.69 114.44,116.19 113.94,116.69 R22.1
N$29
  Bottom 0.127: D17.A 14.94,112.69 15.94,113.69 15.94,116.19 16.44,116.69 R21.1
N$30
  Top 0.127: D16.A 96.19,99.19 96.19,98.94 95.94,98.94 R20.1
N$31
  Top 0.127: D15.A 98.19,97.19 98.19,96.94 97.94,96.94 R19.1
N$32
  Top 0.127: D14.A 103.44,106.69 102.69,107.44 102.69,108.44 106.44,112.19 106.69,112.19 108.19,113.69 108.94,113.69 109.69,112.94 R18.1
N$33  (via drill 0.2)
  Top 0.127: v104.69,105.44 105.44,104.69 D13.A | R17.1 v111.19,110.19
  Bottom 0.127: v104.69,105.44 109.44,110.19 v111.19,110.19
N$34
  Top 0.127: D12.A 34.19,99.19 34.19,98.94 34.44,98.94 R16.1
N$35
  Top 0.127: D11.A 32.19,97.19 32.19,96.94 32.44,96.94 R15.1
N$36
  Top 0.127: D10.A 26.94,106.69 27.69,107.44 27.69,108.44 23.94,112.19 23.69,112.19 22.19,113.69 21.44,113.69 20.69,112.94 R14.1
N$37
  Top 0.127: D8.A 24.69,104.44 23.94,103.69 23.44,103.69 17.69,109.44 17.69,109.94 18.44,110.69 R11.1
N$38  (via drill 0.2)
  Top 0.127: v23.44,23.94 23.94,24.44 D9.C 24.44,24.69 23.69,25.44 23.69,26.69 D20.C 31.69,34.44 32.44,33.69 32.94,33.69 37.19,37.94 38.19,37.94 Q5.D v38.19,39.69 | 24.94,107.19 25.44,107.69 D10.C | 24.94,107.19 23.69,105.94 D8.C 22.94,105.94 v22.44,106.44 | v37.19,88.69 36.69,89.19 36.19,89.19 D24.C 36.19,93.19 33.94,93.19 26.69,100.44 26.69,100.94 27.44,101.69 D11.C 27.69,101.94 29.44,103.69 D12.C 29.19,103.94 28.44,104.69 27.44,104.69 24.94,107.19
  Bottom 0.127: v23.44,23.94 19.69,23.94 13.69,17.94 13.69,16.69 D22.C | v22.44,106.44 19.69,106.44 13.69,112.44 13.69,113.69 D17.C | 39.94,68.69 37.19,71.44 v37.19,88.69 | 39.94,68.69 40.19,68.44 D19.C 39.94,68.69 | v38.19,39.69 37.94,39.94 37.94,66.69 39.94,68.69
N$39  (via drill 0.2)
  Top 0.127: D25.C v99.69,33.69 106.69,26.69 106.69,25.44 | 106.69,25.44 105.94,24.69 D21.C | 106.69,25.44 v106.94,25.19 | D14.C 104.94,107.69 106.69,105.94 D13.C | v107.94,106.44 107.44,105.94 D13.C | D13.C 106.94,105.69 107.69,104.94 107.69,104.44 105.94,102.69 103.69,102.69 D15.C 102.69,101.94 100.94,103.69 D16.C 100.69,103.94 99.94,104.69 99.44,104.69 92.44,97.69 92.19,97.69 92.19,95.69 | 92.19,95.69 Q6.D | 92.19,95.69 v92.44,95.69
  Bottom 0.127: v106.94,25.19 109.44,25.19 116.69,17.94 116.69,16.69 D23.C | v107.94,106.44 110.69,106.44 116.69,112.44 116.69,113.69 D18.C | v99.69,33.69 92.44,40.94 v92.44,95.69
N$40
  Top 0.127: D25.A 97.44,35.69 96.44,34.69 96.44,32.19 95.94,31.69 R27.1
PG0  (via drill 0.2)
  Top 0.127: R2.2 79.19,68.19 v77.69,68.19 | v62.94,83.69 62.94,84.94 62.69,84.94 62.44,85.19 U1.14
  Route2 0.127: v77.69,68.19 77.69,69.19 68.94,77.94 68.94,78.44 63.69,83.69 v62.94,83.69
PG1  (via drill 0.2)
  Top 0.127: R3.2 82.19,68.69 81.69,68.69 76.69,73.69 v74.44,73.69 | v62.19,84.69 62.19,84.94 61.94,85.19 U1.15
  Route2 0.127: v74.44,73.69 73.69,74.44 73.44,74.44 63.19,84.69 v62.19,84.69
RESET  (via drill 0.2)
  Top 0.127: R1.1 71.19,50.94 70.69,50.44 70.69,48.19 69.19,46.69 | B3.2 69.19,46.69 | 69.19,46.69 69.44,46.44 70.19,46.44 70.94,45.69 71.44,45.69 75.94,41.19 79.19,41.19 C9.2 | v46.19,65.19 C22.2 | U1.12 63.44,81.44 v62.44,81.44 | B3.1 61.44,46.69 61.19,46.94 54.19,46.94 52.94,45.69 J1.5
  Route2 0.127: v46.19,65.19 v62.44,81.44
  Bottom 0.127: v46.19,65.19 49.94,61.44 49.94,48.44 52.69,45.69 J1.5
RX0  (via drill 0.2)
  Top 0.127: U1.46 67.94,77.94 v67.44,77.94
  Route2 0.127: v67.44,77.94 65.69,76.19 61.69,76.19 49.69,64.19 49.69,57.69 J7.1 50.69,53.69 50.69,37.69 51.69,36.69 59.19,36.69 63.69,32.19 J3.TXO
SCK  (via drill 0.2)
  Top 0.127: U1.37 63.44,74.94 62.94,74.44 62.94,73.94 v60.44,73.94
  Bottom 0.127: v60.44,73.94 53.94,67.44 53.94,53.94 51.69,51.69 51.69,49.69 52.69,48.69 52.69,48.19 J1.3
SCL  (via drill 0.2)
  Top 0.127: R5.1 76.19,67.94 v73.69,67.94
  Top 0.15: U1.25 v58.94,80.94 | v63.99,61.99 63.99,62.29 64.54,62.84 U2.SCL/SPC
  Route2 0.127: v73.69,67.94 72.19,66.44 71.69,66.44 62.44,57.19 J5.2
  Route15 0.127: J4.3 49.44,38.19 58.94,47.69 58.94,53.19 62.44,56.69 62.44,57.19 J5.2
  Bottom 0.127: 63.19,61.19 62.44,60.44 62.44,57.19 J5.2 | 63.19,61.19 v63.99,61.99 | 63.19,61.19 60.94,63.44 60.94,78.94 v58.94,80.94
SDA  (via drill 0.2)
  Top 0.127: R4.1 73.19,66.94 v71.94,66.94 | U1.26 58.94,80.44 v58.44,79.94
  Top 0.15: v65.69,61.99 65.69,62.39 65.4,62.67 U2.SDA/SDI/SDO
  Route2 0.127: J5.1 65.19,51.44 51.94,38.19 J4.4
  Bottom 0.127: 65.44,60.44 65.44,57.44 J5.1 | 65.44,60.44 65.44,61.69 65.69,61.94 v65.69,61.99 | 65.44,60.44 71.69,66.69 | 71.69,66.69 v71.94,66.94 | v58.44,79.94 57.69,80.69 57.69,81.69 57.94,81.94 61.44,81.94 61.44,76.94 71.69,66.69
TX0  (via drill 0.2)
  Top 0.15: U1.47 v68.44,74.94
  Route2 0.127: v68.44,74.94 62.64,69.14 62.64,62.24 61.09,60.69 55.19,60.69 52.19,57.69 J7.2
  Route15 0.127: J3.RXI 61.19,32.19 56.69,36.69 49.19,36.69 48.19,37.69 48.19,40.69 49.69,42.19 49.69,55.19 52.19,57.69 J7.2
VBAT  (via drill 0.61)
  Top 0.762: D5.C v85.19,51.06 | R16.2 v36.78,96.59 | D4.C v85.19,79.31 | R20.2 v93.59,96.59 | C15.1 v46.19,78.1 | R11.2 v20.78,108.59 | R14.2 v22.78,110.59 | R26.2 v40.19,90.41 | R24.2 v36.78,33.78 | D3.C v45.19,79.31 | D6.C v45.19,51.06 | R15.2 v34.78,94.59 | R12.2 v30.78,30.78 | R17.2 v109.59,108.59 | R18.2 v107.59,110.59 | R19.2 v95.59,94.59 | R28.2 v99.59,30.78 | C17.1 v84.19,52.27 | R27.2 v93.59,33.78 | C16.1 v84.19,78.1 | C18.1 v46.19,52.27 | C20.2 v80.19,50.37 | v74.94,44.19 74.94,44.69 | 74.94,44.69 74.94,46.44 75.19,46.69 U7.1 | 74.94,44.69 76.69,44.69 77.44,45.44 77.44,46.44 77.19,46.69 U7.3
  Route15 0.762: 67.19,36.19 67.19,38.19 J4.10
  Bottom 0.762: R13.2 v18.78,15.78 | R13.2 | R21.2 v18.78,114.59 | R21.2 | R22.2 v111.59,114.59 | R22.2 | R25.2 v111.59,15.78 | R25.2 | v40.19,60.19 R23.2 | v74.94,44.19 75.94,44.19 77.19,45.44 77.19,47.19 80.19,50.19 v80.19,50.37
  pour Route15: 49.19,93.19 49.19,42.19 42.19,42.19 42.19,36.19 69.19,36.19 69.19,44.19 77.19,44.19 77.19,43.19 81.19,43.19 81.19,44.19 83.19,44.19 83.19,52.19 81.19,52.19 81.19,63.19 84.19,63.19 84.19,68.19 81.19,68.19 81.19,93.19 89.19,93.19 89.19,96.19 113.19,120.19 120.19,113.19 96.19,89.19 96.19,42.19 121.19,17.19 114.19,10.19 113.19,10.19 89.19,34.19 66.19,11.19 17.19,11.19 11.19,17.19 10.19,114.19 17.19,121.19 41.19,96.19 41.19,93.19

### Text on the board
tPlace: DTR | TX | 3V3 | GND | SCL | SDA | GND | RX | BATGND | GND | SCL | SDA | PWM1 | 3V3 | PWM2 | PWM3 | PWM4 | VBAT
bPlace: DTR | TX | GND | RX